# Altium project STM32F466_EVAL_BOARD.PrjPcb
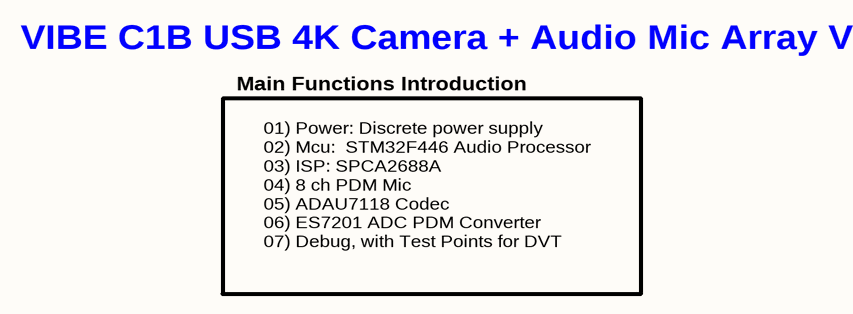
[diagram p0: 00_TITLE.SchDoc]
Revision: V1.0; Title: Test
13 sheets, 217 parts. Net scope: global (net labels, ports and power ports of the same name join across sheets).
Board files: C1B_EVAL_DEV.PcbDoc, PCB1.PcbDoc
Sheets:
  00_TITLE.SchDoc
  01_SYSTEM_DIAGRAM.SchDoc
  02_REVISIONS.SchDoc
  05_SM32_MCU.SchDoc
  06_USB_HUB20.SchDoc
  07_ISP.SchDoc
  10_PDM_MICS.SchDoc
  11_ES7201_LOOPBACK.SchDoc
  12_ADAU7118_CODEC.SchDoc
  21_POWER_DOMAINS.SchDoc
  22_USB_CONNECTOR.SchDoc
  99_MISCS.SchDoc
  temp_packages.SchDoc

## Sheet 00_TITLE.SchDoc: Test
size B; DocumentNumber: 1; SheetNumber: 1; SheetTotal: 12

### Notes on the sheet
- VIBE C1B USB 4K Camera + Audio Mic Array V1
- Main Functions Introduction
- 01) Power: Discrete power supply
  02) Mcu:  STM32F446 Audio Processor
  03) ISP: SPCA2688A
  04) 8 ch PDM Mic
  05) ADAU7118 Codec
  06) ES7201 ADC PDM Converter
  07) Debug, with Test Points for DVT
- Title
- Size:
- Date:
- B
- Number:
- Time:
- Revision:
- Sheet
- of
- Author: Edward Lai
- Email: edward@vibe.us
- Vibe Inc
- Hangzhou
- vibe.us <http://vibe.us>
- File:

## Sheet 01_SYSTEM_DIAGRAM.SchDoc: System Diagram
size B; DocumentNumber: 2; SheetNumber: 2; SheetTotal: 12

### Notes on the sheet
- Title
- Size:
- Date:
- B
- Number:
- Time:
- Revision:
- Sheet
- of
- Author: Edward Lai
- Email: edward@vibe.us
- Vibe Inc
- Hangzhou
- vibe.us <http://vibe.us>
- File:

## Sheet 02_REVISIONS.SchDoc: Revisions
size B; DocumentNumber: 3; SheetNumber: 3; SheetTotal: 12
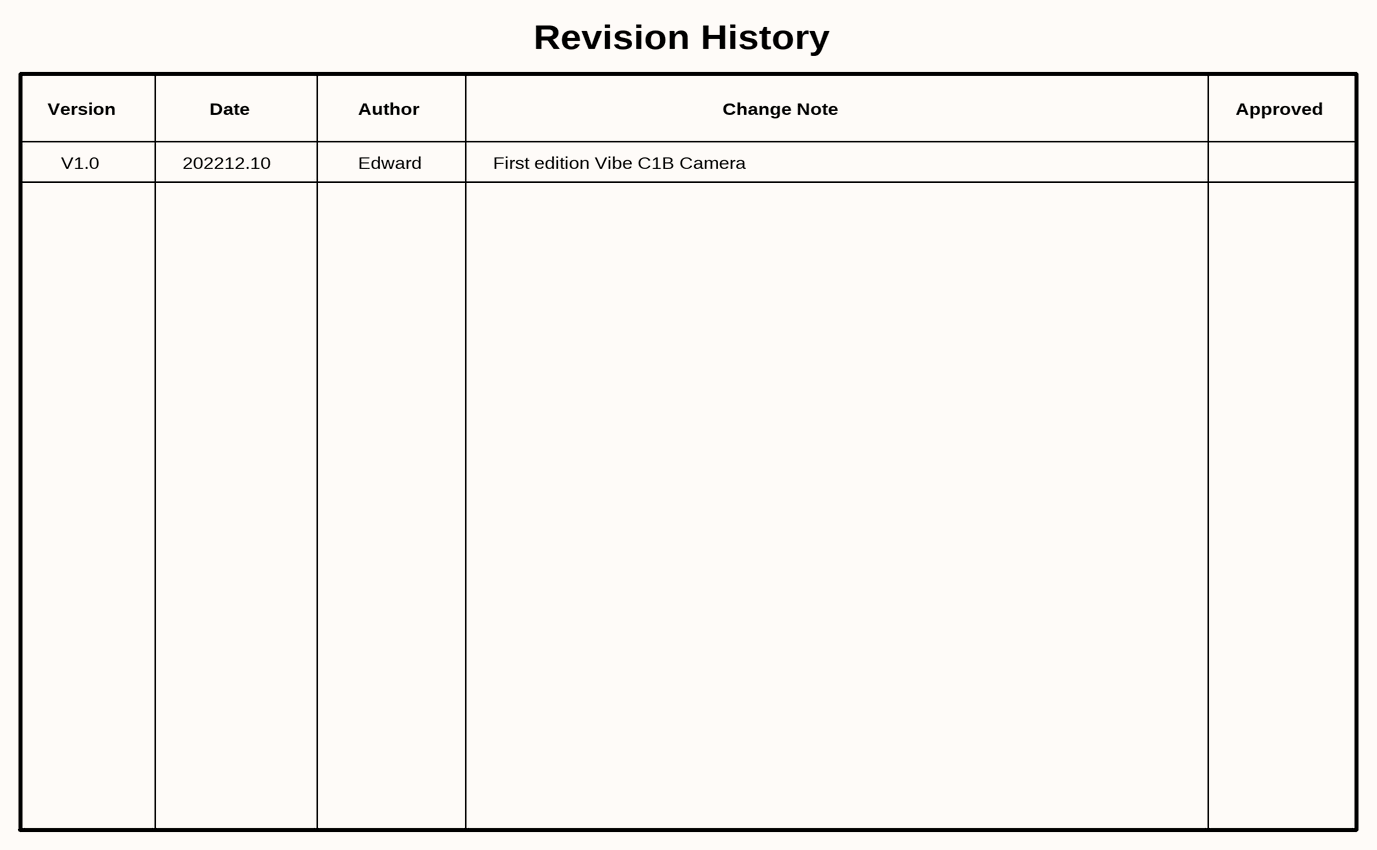
[diagram p1: 02_REVISIONS.SchDoc]

### Notes on the sheet
- Revision History
- Version
- Date
- Author
- Change Note
- Approved
- V1.0
- 202212.10
- Edward
- First edition Vibe C1B Camera
- Title
- Size:
- Date:
- B
- Number:
- Time:
- Revision:
- Sheet
- of
- Author: Edward Lai
- Email: edward@vibe.us
- Vibe Inc
- Hangzhou
- vibe.us <http://vibe.us>
- File:

## Sheet 05_SM32_MCU.SchDoc: STM32 F446 MCU
size B; DocumentNumber: 4; SheetNumber: 4; SheetTotal: 12
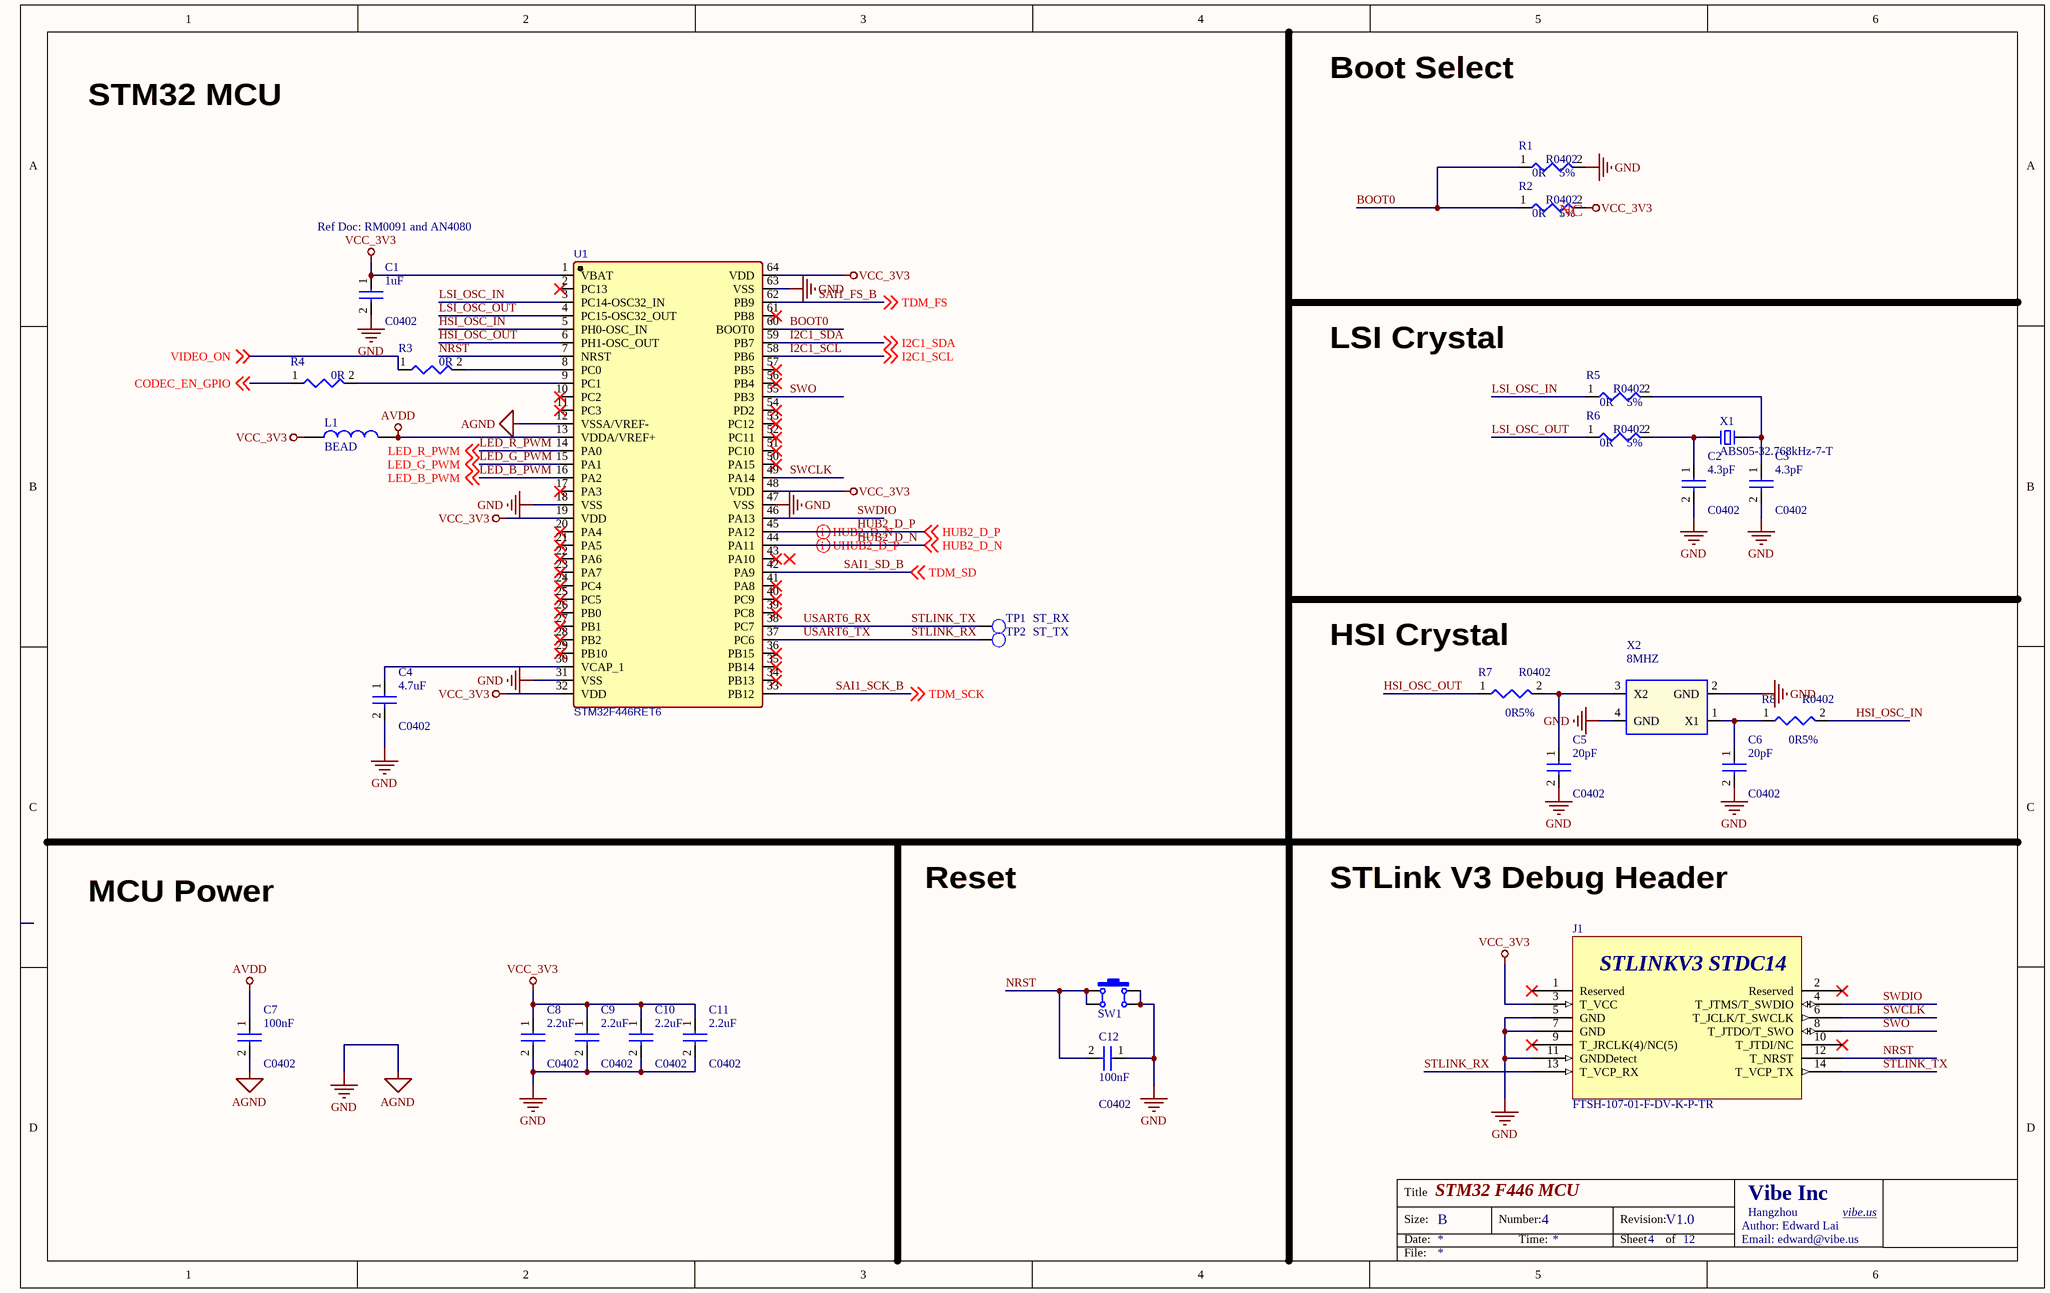
[diagram p2: 05_SM32_MCU.SchDoc]

### Parts
C1  1uF  PCB Footprint: C0402  [C0402_L]
C2  4.3pF  PCB Footprint: C0402  [C0402_L]
C3  4.3pF  PCB Footprint: C0402  [C0402_L]
C4  4.7uF  PCB Footprint: C0402  [C0402_L]
C5  20pF  PCB Footprint: C0402  [C0402_L]
C6  20pF  PCB Footprint: C0402  [C0402_L]
C7  100nF  PCB Footprint: C0402  [C0402_L]
C8  2.2uF  PCB Footprint: C0402  [C0402_L]
C9  2.2uF  PCB Footprint: C0402  [C0402_L]
C10  2.2uF  PCB Footprint: C0402  [C0402_L]
C11  2.2uF  PCB Footprint: C0402  [C0402_L]
C12  100nF  PCB Footprint: C0402  [C0402_L]
J1  FTSH-107-01-F-DV-K-P-TR  [SAMTEC-FTSH-107-01-X-DV]
L1  BEAD  [L0402]
R1  0R  Tolerance: 5%  [R0402]
R2  0R  Tolerance: 5%  [R0402]  (net tie, no BOM)
R3  0R  [R0402]
R4  0R  [R0402]
R5  0R  Tolerance: 5%  [R0402]
R6  0R  Tolerance: 5%  [R0402]
R7  0R  Tolerance: 5%  [R0402]
R8  0R  Tolerance: 5%  [R0402]
SW1  4x4x1.5  [TSW SMD-6*6*5]  (value not drawn)
TP1  ST_RX  [TP_0R70]  (no BOM)
TP2  ST_TX  [TP_0R70]  (no BOM)
U1  STM32F446RET6  [LQFP64_L]
X1  ABS05-32.768kHz-7-T  [XTAL_3215-32.768K]
X2  8MHZ  [XTAL_3225-8MHZ]

### Nets
AGND: C1.2 C2.2 C3.2 C4.2 C5.2 C6.2 C7.2 C8.2 C9.2 C10.2 C11.2 C12.1 J1.5(GND) J1.7(GND) J1.11(GNDDetect) R1.2 SW1.2 SW1.3 U1.12(VSSA/VREF-) U1.18(VSS) U1.31(VSS) U1.47(VSS) U1.63(VSS) X2.2(GND) X2.4(GND)  [also labelled GND]
AVDD: C7.1 L1.2 U1.13(VDDA/VREF+)
VCC_3V3: C1.1 C8.1 C9.1 C10.1 C11.1 J1.3(T_VCC) L1.1 R2.2 U1.1(VBAT) U1.19(VDD) U1.32(VDD) U1.48(VDD) U1.64(VDD)
BOOT0: R1.1 R2.1 U1.60(BOOT0)
CODEC_EN_GPIO: R4.1 ; off-sheet CODEC_EN_GPIO  [project net CODEC_EN]
HSI_OSC_IN: R8.2 U1.5(PH0-OSC_IN)
HSI_OSC_OUT: R7.1 U1.6(PH1-OSC_OUT)
HUB2_D_N: U1.44(PA11) ; off-sheet HUB2_D_N
HUB2_D_P: U1.45(PA12) ; off-sheet HUB2_D_P
I2C1_SCL: U1.58(PB6) ; off-sheet I2C1_SCL
I2C1_SDA: U1.59(PB7) ; off-sheet I2C1_SDA
LED_B_PWM: U1.16(PA2) ; off-sheet LED_B_PWM
LED_G_PWM: U1.15(PA1) ; off-sheet LED_G_PWM
LED_R_PWM: U1.14(PA0) ; off-sheet LED_R_PWM
LSI_OSC_IN: R5.1 U1.3(PC14-OSC32_IN)
LSI_OSC_OUT: R6.1 U1.4(PC15-OSC32_OUT)
NRST: C12.2 J1.12(T_NRST) SW1.1 SW1.4 U1.7(NRST)
SAI1_FS_B: U1.62(PB9) ; off-sheet TDM_FS  [also labelled TDM_FS]
SAI1_SCK_B: U1.33(PB12) ; off-sheet TDM_SCK  [also labelled TDM_SCK]
SAI1_SD_B: U1.42(PA9) ; off-sheet TDM_SD  [also labelled TDM_SD]
STLINK_RX: J1.13(T_VCP_RX) TP2.1 U1.37(PC6)  [also labelled USART6_TX]
STLINK_TX: J1.14(T_VCP_TX) TP1.1 U1.38(PC7)  [also labelled USART6_RX]
SWCLK: J1.6(T_JCLK/T_SWCLK) U1.49(PA14)
SWDIO: J1.4(T_JTMS/T_SWDIO) U1.46(PA13)
SWO: J1.8(T_JTDO/T_SWO) U1.55(PB3)
VIDEO_ON: R3.1 ; off-sheet VIDEO_ON  [project net XHIGHDRV]
NetC2_1: C2.1 R6.2 X1.1
NetC3_1: C3.1 R5.2 X1.2
NetC4_1: C4.1 U1.30(VCAP_1)
NetC5_1: C5.1 R7.2 X2.3(X2)
NetC6_1: C6.1 R8.1 X2.1(X1)
NetR3_2: R3.2 U1.8(PC0)
NetR4_2: R4.2 U1.9(PC1)

Not connected (* = marked no-connect by the designer): J1 1(Reserved)* 2(Reserved)* 9(T_JRCLK(4)/NC(5))* 10(T_JTDI/NC)*; U1 2(PC13)* 10(PC2)* 11(PC3)* 17(PA3)* 20(PA4)* 21(PA5)* 22(PA6)* 23(PA7)* 24(PC4)* 25(PC5)* 26(PB0)* 27(PB1)* 28(PB2)* 29(PB10)* 34(PB13)* 35(PB14)* 36(PB15)* 39(PC8)* 40(PC9)* 41(PA8)* 43(PA10)* 50(PA15)* 51(PC10)* 52(PC11)* 53(PC12)* 54(PD2)* 56(PB4)* 57(PB5)* 61(PB8)*

### Layout directives
differential pair; differential pair class USB: HUB2_D_N, HUB2_D_P

### Notes on the sheet
- Boot Select
- STM32 MCU
- Ref Doc: RM0091 and AN4080
- (near R2) NC
- LSI Crystal
- (near R7) HSI Crystal
- MCU Power
- Reset
- STLink V3 Debug Header
- Title
- Size:
- Date:
- B
- Number:
- Time:
- Revision:
- Sheet
- of
- Author: Edward Lai
- Email: edward@vibe.us
- Vibe Inc
- Hangzhou
- vibe.us <http://vibe.us>
- File:
- (in symbol FTSH-107-01-F-DV-K-P-TR) STLINKV3 STDC14

### Library data of the parts
C1 = CAP NP_Dup1: cap,1.00uF,+/-10%,10V,X5R,C0402; Priority: A; Part Type: C0402
C2 C3 = CAP NP_Dup1: cap,4.3pF,+/-10%,25V,X5R,C0402; Priority: A; Part Type: C0402
C4 = CAP NP_Dup1: cap,4.70uF,+/-10%,6.3V,X5R,C0402; Priority: A; Part Type: C0402
C5 C6 = CAP NP_Dup1: cap,20pF,+/-10%,25V,X5R,C0402; Priority: A; Part Type: C0402
C7 C12 = CAP NP_Dup1: cap,100.00nF,+/-10%,10V,X5R,C0402; Priority: A; Part Type: C0402
C8-C11 = CAP NP_Dup1: cap,2.20uF,+/-10%,10V,X5R,C0402; Priority: A; Part Type: C0402
J1 = FTSH-107-01-F-DV-K-P-TR: Samtec 14Pin 2x7 Header Connector. / STM32_STLINK_V3 Debug
L1 = L-AL: 鐵氧體磁珠 33ohm 0.55A 550mOhms 0402 Chip Bead
R1 R2 R5-R8 = RESISTOR: 通用厚膜电阻,0R,+/-5%,R0402; Priority: A; PCB Footprint: R0402; Part Type: 通用厚膜电阻
R3 R4 = RESISTOR: 通用厚膜电阻,0R,+/-5%,R0402; Tolerance: 5%; Priority: A; PCB Footprint: R0402; Part Type: 通用厚膜电阻
SW1 = SW SMD-4x4: 贴片4x4轻触开关
TP1 TP2 = TP: Test Point 0.7mm; PCB Footprint: TP_0R50; Priority: A; Part Type: TP
X1 = XTAL-2P: ABS05-32.768kHz-7-T / 3215 2脚无源晶振(谐振器）
X2 = CRYSTAL_4P: 8MHZ (16pF), 3.2 mm x 2.5 mm / 无源晶振(谐振器）

## Sheet 06_USB_HUB20.SchDoc: USB Hub 2.0
size B; DocumentNumber: 5; Revision: V1.0; SheetNumber: 5; SheetTotal: 12
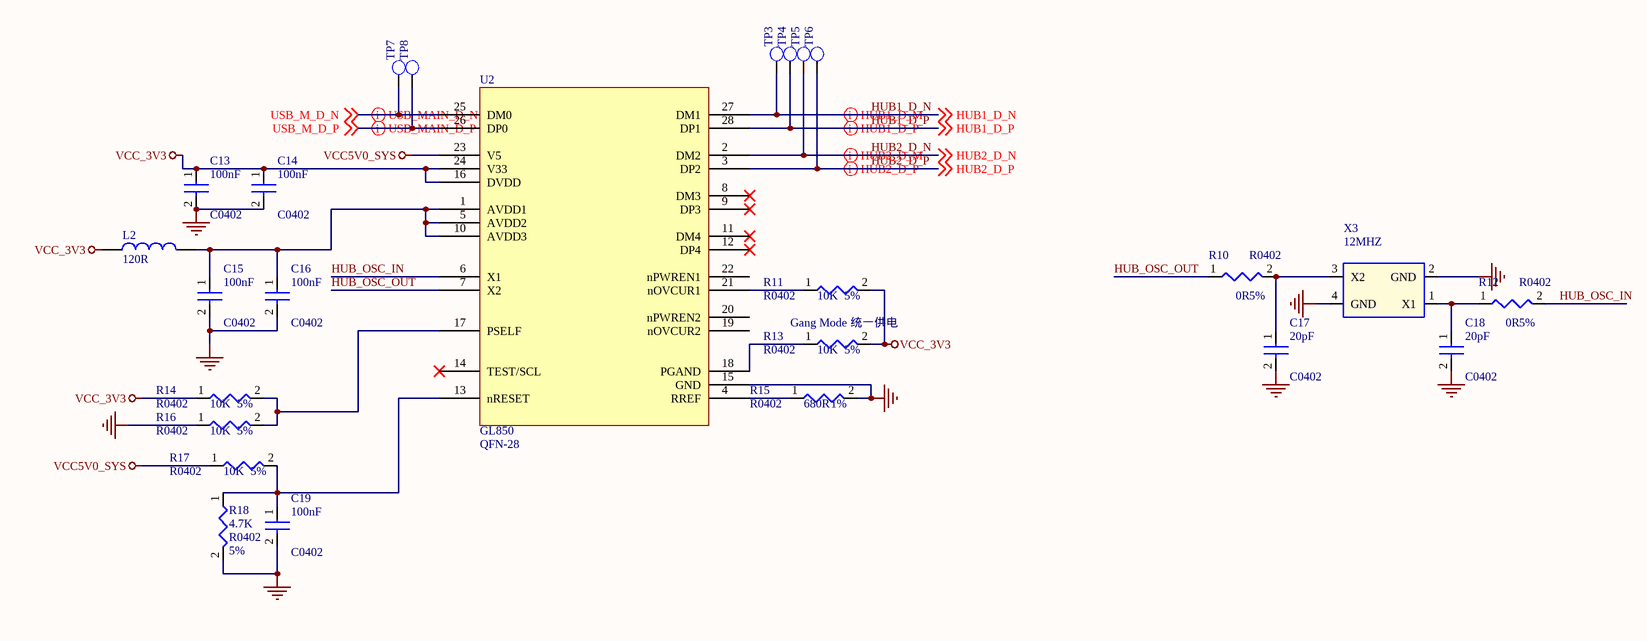
[diagram p3: 06_USB_HUB20.SchDoc]

### Parts
(Parts that share a designator on the sheet are numbered #1, #2 ... from top to bottom, then left to right.)
C13  100nF  PCB Footprint: C0402  [C0402_L]
C14  100nF  PCB Footprint: C0402  [C0402_L]
C15  100nF  PCB Footprint: C0402  [C0402_L]
C16  100nF  PCB Footprint: C0402  [C0402_L]
C17  20pF  PCB Footprint: C0402  [C0402_L]
C18  20pF  PCB Footprint: C0402  [C0402_L]
C19  100nF  PCB Footprint: C0402  [C0402_L]
L2  120R  [L0402]
R10  0R  Tolerance: 5%  [R0402]
R11  10K  Tolerance: 5%  [R0402]
R12  0R  Tolerance: 5%  [R0402]
R13  10K  Tolerance: 5%  [R0402]
R14  10K  Tolerance: 5%  [R0402]
R15  680R  Tolerance: 1%  [R0402]
R16#1  10K  Tolerance: 5%  [R0402]
R17#1  10K  Tolerance: 5%  [R0402]
R18#1  4.7K  Tolerance: 5%  [R0402]
TP3  (no value)  [TP_0R70]  (no BOM)
TP4  (no value)  [TP_0R70]  (no BOM)
TP5  (no value)  [TP_0R70]  (no BOM)
TP6  (no value)  [TP_0R70]  (no BOM)
TP7  (no value)  [TP_0R70]  (no BOM)
TP8  (no value)  [TP_0R70]  (no BOM)
U2  GL850  [QFN-28]
X3  12MHZ  [XTAL_3225-8MHZ]

### Nets
GND: C13.2 C14.2 C15.2 C16.2 C17.2 C18.2 C19.2 R15.2 R16#1.1 R18#1.2 U2.15(GND) X3.2(GND) X3.4(GND)  [project net AGND]
VCC5V0_SYS: R17#1.1 U2.23(V5)
VCC_3V3: C13.1 C14.1 L2.1 R11.2 R13.2 R14.1 U2.16(DVDD) U2.24(V33)
HUB1_D_N: TP3.1 U2.27(DM1) ; off-sheet HUB1_D_N
HUB1_D_P: TP4.1 U2.28(DP1) ; off-sheet HUB1_D_P
HUB2_D_N: TP5.1 U2.2(DM2) ; off-sheet HUB2_D_N
HUB2_D_P: TP6.1 U2.3(DP2) ; off-sheet HUB2_D_P
HUB_OSC_IN: R12.2 U2.6(X1)
HUB_OSC_OUT: R10.1 U2.7(X2)
USB_M_D_N: TP7.1 U2.25(DM0) ; off-sheet USB_M_D_N
USB_M_D_P: TP8.1 U2.26(DP0) ; off-sheet USB_M_D_P
NetC15_1: C15.1 C16.1 L2.2 U2.1(AVDD1) U2.5(AVDD2) U2.10(AVDD3)
NetC17_1: C17.1 R10.2 X3.3(X2)
NetC18_1: C18.1 R12.1 X3.1(X1)
NetC19_1: C19.1 R17#1.2 R18#1.1 U2.13(nRESET)
NetR11_1: R11.1 U2.21(nOVCUR1)
NetR13_1: R13.1 U2.18(PGAND)
NetR14_2: R14.2 R16#1.2 U2.17(PSELF)
NetR15_1: R15.1 U2.4(RREF)

Not connected (* = marked no-connect by the designer): U2 8(DM3)* 9(DP3)* 11(DM4)* 12(DP4)* 14(TEST/SCL)* 19(nOVCUR2) 20(nPWREN2) 22(nPWREN1)

### Layout directives
differential pair; differential pair class USB: HUB1_D_N, HUB1_D_P, HUB2_D_N, HUB2_D_P, USB_M_D_N, USB_M_D_P

### Notes on the sheet
- (near R13) Gang Mode 统一供电
- Title
- Size:
- Date:
- B
- Number:
- Time:
- Revision:
- Sheet
- of
- Author: Edward Lai
- Email: edward@vibe.us
- Vibe Inc
- Hangzhou
- vibe.us <http://vibe.us>
- File:

### Library data of the parts
C13-C16 C19 = CAP NP_Dup1: as C7 on sheet 05_SM32_MCU; Part Type: C0402
C17 C18 = CAP NP_Dup1: as C5 on sheet 05_SM32_MCU; Part Type: C0402
L2 = L: 鐵氧體磁珠 120 OHM 25%
R10 R12 = RESISTOR: 通用厚膜电阻,0R,+/-5%,R0402; Priority: A; PCB Footprint: R0402; Part Type: 通用厚膜电阻
R11 R13 R14 R16#1 R17#1 = RESISTOR: 通用厚膜电阻,10K,+/-5%,R0402; Priority: A; PCB Footprint: R0402; Part Type: 通用厚膜电阻
R15 = RESISTOR: 通用厚膜电阻,680R,+/-1%,R0402; Priority: A; PCB Footprint: R0402; Part Type: 通用厚膜电阻
R18#1 = RESISTOR: 通用厚膜电阻,4.7K,+/-5%,R0402; Priority: A; PCB Footprint: R0402; Part Type: 通用厚膜电阻
TP3-TP8 = TP: as TP1 on sheet 05_SM32_MCU; Part Type: TP
U2 = GL850G: GL850 4 Port USB HUB QFN-28; Package: QFN-28
X3 = CRYSTAL_4P: 12MHZ (16pF), 3.2 mm x 2.5 mm / 无源晶振(谐振器）

## Sheet 07_ISP.SchDoc: SPCA2688 ISP
size C; DocumentNumber: 9; SheetNumber: 9; SheetTotal: 12
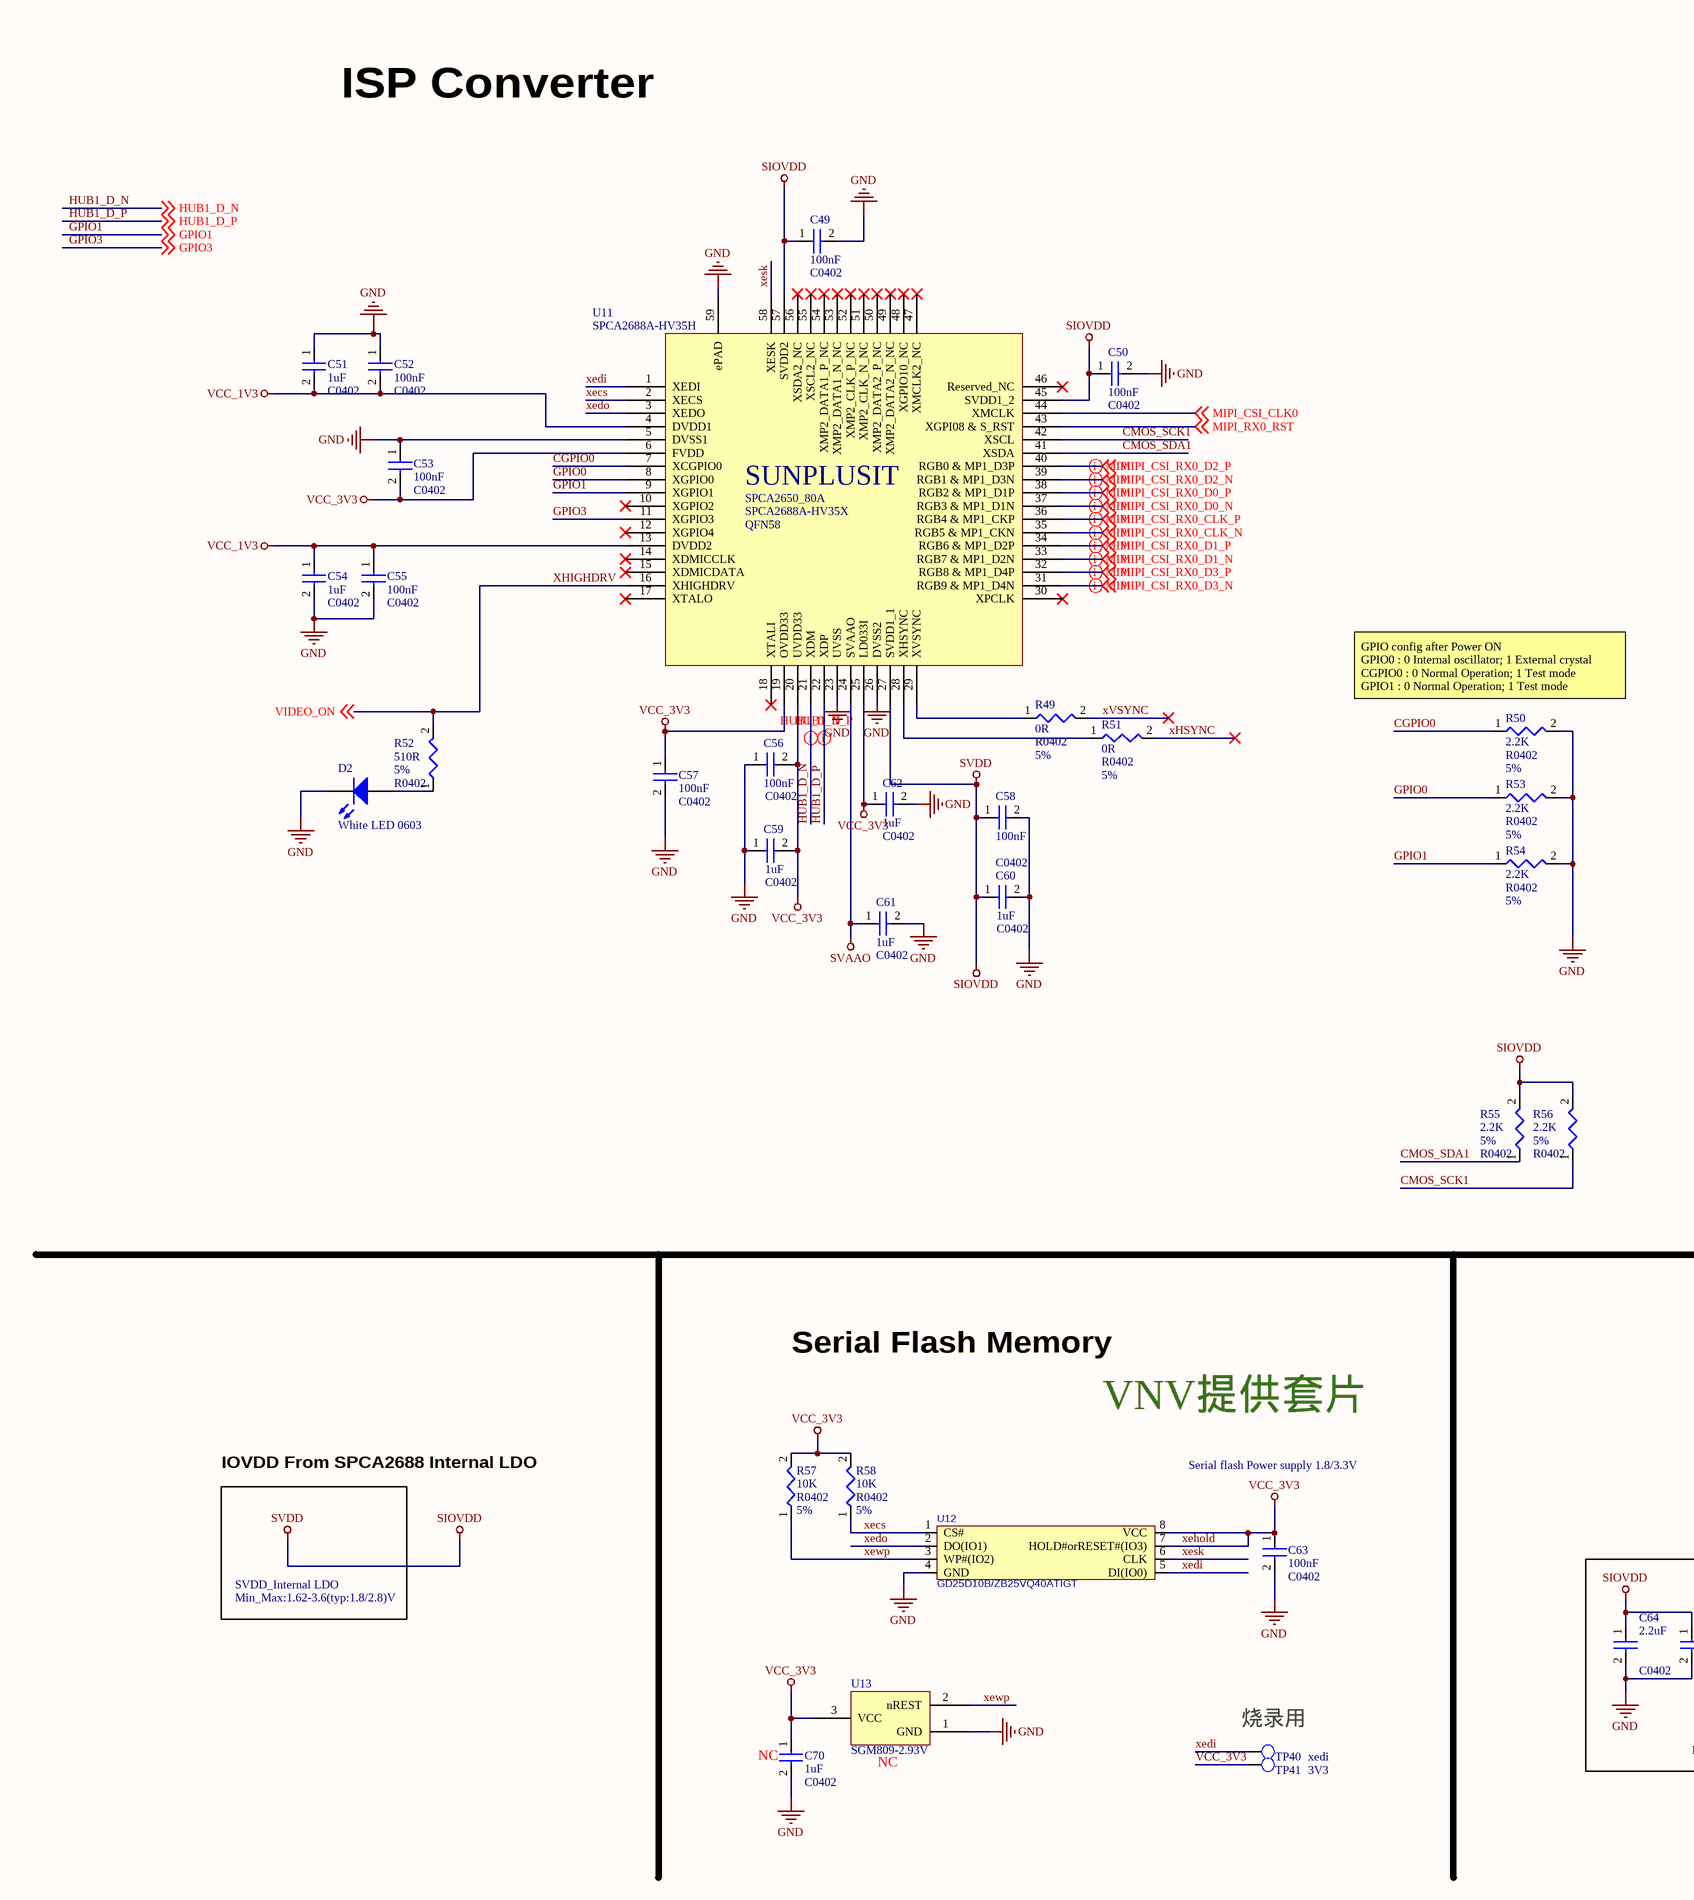
[diagram p4: 07_ISP.SchDoc, left]
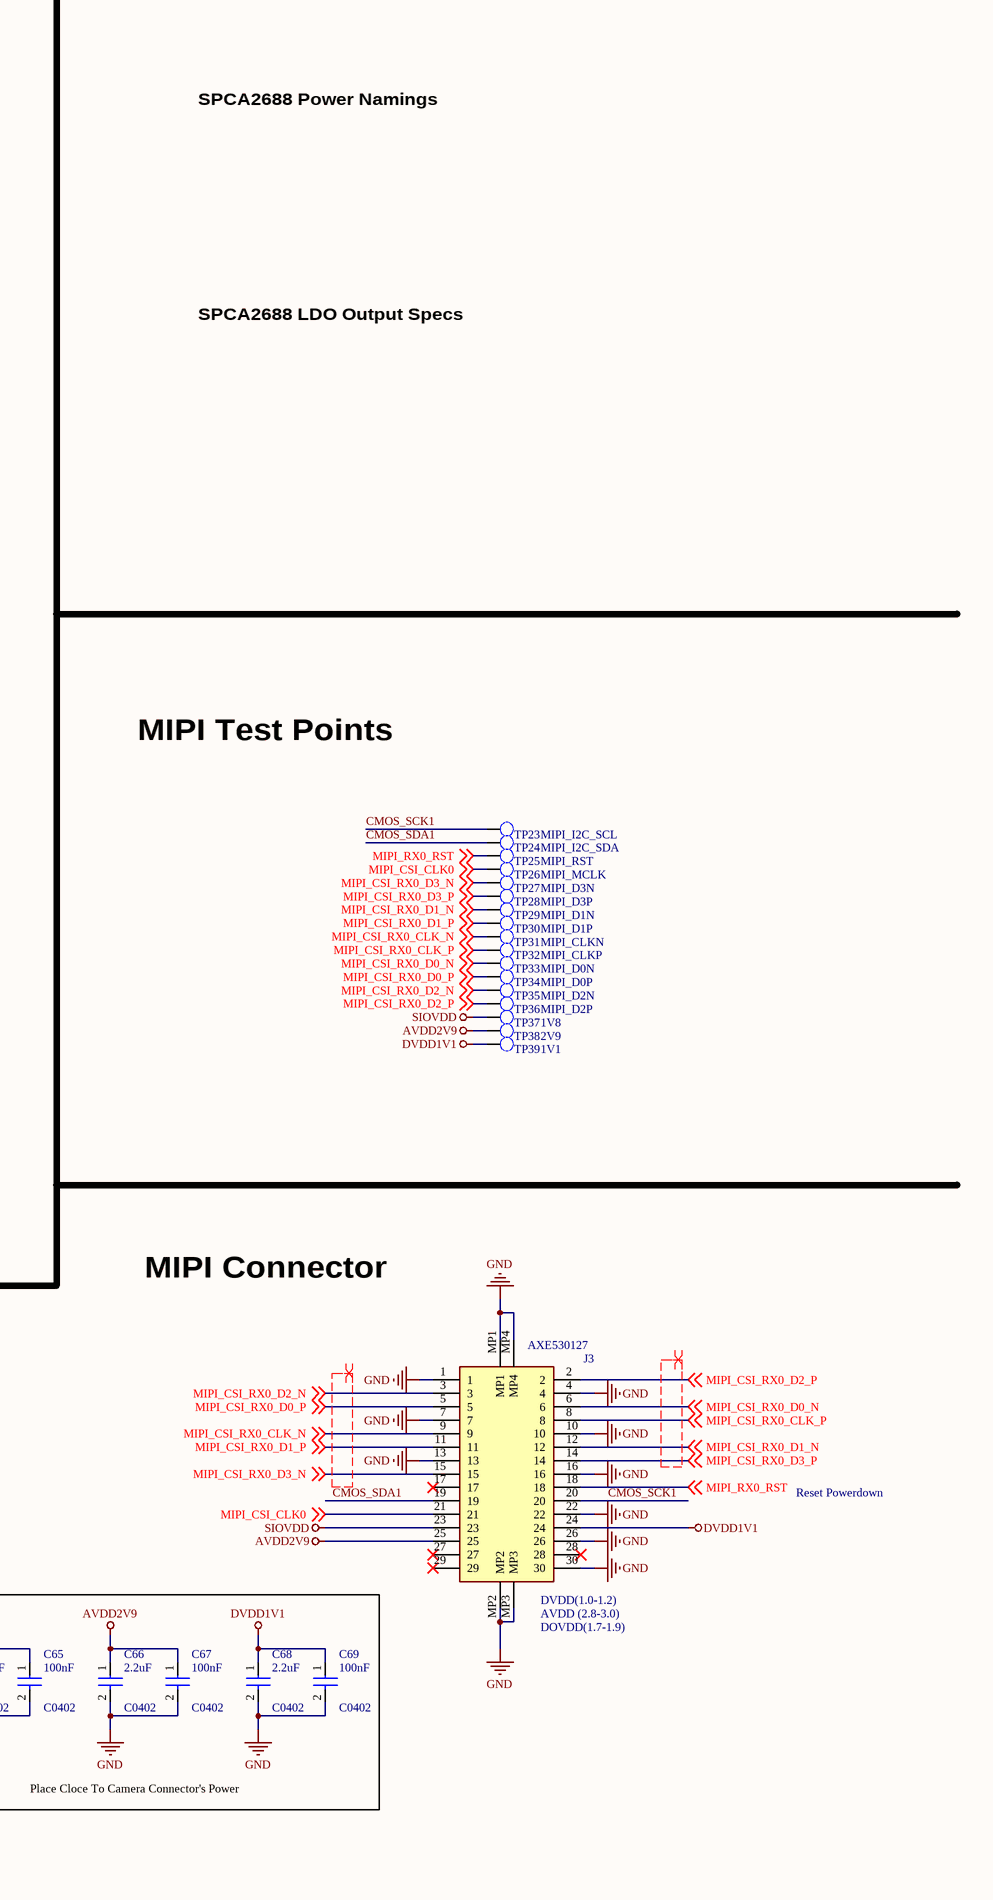
[diagram p5: 07_ISP.SchDoc, right]

### Parts
(Parts that share a designator on the sheet are numbered #1, #2 ... from top to bottom, then left to right.)
C49  100nF  PCB Footprint: C0402  [C0402_L]
C50  100nF  PCB Footprint: C0402  [C0402_L]
C51  1uF  PCB Footprint: C0402  [C0402_L]
C52  100nF  PCB Footprint: C0402  [C0402_L]
C53  100nF  PCB Footprint: C0402  [C0402_L]
C54#1  1uF  PCB Footprint: C0402  [C0402_L]
C55#1  100nF  PCB Footprint: C0402  [C0402_L]
C56#1  100nF  PCB Footprint: C0402  [C0402_L]
C57#1  100nF  PCB Footprint: C0402  [C0402_L]
C58#1  100nF  PCB Footprint: C0402  [C0402_L]
C59#1  1uF  PCB Footprint: C0402  [C0402_L]
C60#1  1uF  PCB Footprint: C0402  [C0402_L]
C61#1  1uF  PCB Footprint: C0402  [C0402_L]
C62#1  1uF  PCB Footprint: C0402  [C0402_L]
C63#1  100nF  PCB Footprint: C0402  [C0402_L]
C64#1  2.2uF  PCB Footprint: C0402  [C0402_L]
C65#1  100nF  PCB Footprint: C0402  [C0402_L]
C66#1  2.2uF  PCB Footprint: C0402  [C0402_L]
C67#1  100nF  PCB Footprint: C0402  [C0402_L]
C68#1  2.2uF  PCB Footprint: C0402  [C0402_L]
C69#1  100nF  PCB Footprint: C0402  [C0402_L]
C70  1uF  PCB Footprint: C0402  [C0402_L]
D2  White LED 0603  [LED0603_W]
J3  AXE530127  [AXE530127_counterclock_pin]
R49#1  0R  Tolerance: 5%  [R0402]  (net tie, no BOM)
R50#1  2.2K  Tolerance: 5%  [R0402]
R51#1  0R  Tolerance: 5%  [R0402]  (net tie, no BOM)
R52#1  510R  Tolerance: 5%  [R0402]
R53  2.2K  Tolerance: 5%  [R0402]
R54  2.2K  Tolerance: 5%  [R0402]
R55  2.2K  Tolerance: 5%  [R0402]
R56  2.2K  Tolerance: 5%  [R0402]
R57  10K  Tolerance: 5%  [R0402]
R58  10K  Tolerance: 5%  [R0402]
TP23  MIPI_I2C_SCL  [TP_0R70]  (no BOM)
TP24  MIPI_I2C_SDA  [TP_0R70]  (no BOM)
TP25  MIPI_RST  [TP_0R70]  (no BOM)
TP26  MIPI_MCLK  [TP_0R70]  (no BOM)
TP27  MIPI_D3N  [TP_0R70]  (no BOM)
TP28  MIPI_D3P  [TP_0R70]  (no BOM)
TP29  MIPI_D1N  [TP_0R70]  (no BOM)
TP30  MIPI_D1P  [TP_0R70]  (no BOM)
TP31  MIPI_CLKN  [TP_0R70]  (no BOM)
TP32#1  MIPI_CLKP  [TP_0R70]  (no BOM)
TP33#1  MIPI_D0N  [TP_0R70]  (no BOM)
TP34#1  MIPI_D0P  [TP_0R70]  (no BOM)
TP35#1  MIPI_D2N  [TP_0R70]  (no BOM)
TP36#1  MIPI_D2P  [TP_0R70]  (no BOM)
TP37  1V8  [TP_0R70]  (no BOM)
TP38  2V9  [TP_0R70]  (no BOM)
TP39  1V1  [TP_0R70]  (no BOM)
TP40  xedi  [TP_0R70]  (no BOM)
TP41  3V3  [TP_0R70]  (no BOM)
U11#1  SPCA2688A-HV35H  [SPCA2680A_QFN58]
U12  GD25D10B/ZB25VQ40ATIGT  [SOIC-8]
U13  SGM809-2.93V  [SOT23]  (net tie, no BOM)

### Blocks framed on the sheet
Place Cloce To Camera Connector's Power: C64#1 C65#1 C66#1 C67#1 C68#1 C69#1

### Nets
AVDD2V9: C66#1.1 C67#1.1 J3.25 TP38.1
DVDD1V1: C68#1.1 C69#1.1 J3.24 TP39.1
GND: C49.2 C50.2 C51.1 C52.1 C53.1 C54#1.2 C55#1.2 C56#1.1 C57#1.2 C58#1.2 C59#1.1 C60#1.2 C61#1.2 C62#1.2 C63#1.2 C64#1.2 C65#1.2 C66#1.2 C67#1.2 C68#1.2 C69#1.2 C70.2 D2.2(K) J3.1 J3.4 J3.7 J3.10 J3.13 J3.16 J3.22 J3.26 J3.30 J3.MP1 J3.MP2 J3.MP3 J3.MP4 R50#1.2 R53.2 R54.2 U11#1.5(DVSS1) U11#1.23(UVSS) U11#1.26(DVSS2) U11#1.59(ePAD) U12.4(GND) U13.1(GND)  [project net AGND]
SIOVDD: C49.1 C50.1 C58#1.1 C60#1.1 C64#1.1 C65#1.1 J3.23 R55.2 R56.2 TP37.1 U11#1.27(SVDD1_1) U11#1.45(SVDD1_2) U11#1.57(SVDD2)  [also labelled SVDD]
SVAAO: C61#1.1 U11#1.24(SVAAO)
VCC_1V3: C51.2 C52.2 C54#1.1 C55#1.1 U11#1.4(DVDD1) U11#1.13(DVDD2)
VCC_3V3: C53.2 C56#1.2 C57#1.1 C59#1.2 C62#1.1 C63#1.1 C70.1 R57.2 R58.2 TP41.1 U11#1.6(FVDD) U11#1.19(OVDD33) U11#1.20(UVDD33) U11#1.25(LD033I) U12.7(HOLD#orRESET#(IO3)) U12.8(VCC) U13.3(VCC)  [also labelled xehold]
CGPIO0: R50#1.1 U11#1.7(XCGPIO0)
CMOS_SCK1: J3.20 R56.1 TP23.1 U11#1.42(XSCL)
CMOS_SDA1: J3.19 R55.1 TP24.1 U11#1.41(XSDA)
GPIO0: R53.1 U11#1.8(XGPIO0)
GPIO1: R54.1 U11#1.9(XGPIO1) ; off-sheet GPIO1
GPIO3: U11#1.11(XGPIO3) ; off-sheet GPIO3
HUB1_D_N: U11#1.21(XDM) ; off-sheet HUB1_D_N
HUB1_D_P: U11#1.22(XDP) ; off-sheet HUB1_D_P
MIPI_CSI_CLK0: J3.21 TP26.1 U11#1.44(XMCLK) ; off-sheet MIPI_CSI_CLK0
MIPI_CSI_RX0_CLK_N: J3.9 TP31.1 U11#1.35(RGB5_&_MP1_CKN) ; off-sheet MIPI_CSI_RX0_CLK_N
MIPI_CSI_RX0_CLK_P: J3.8 TP32#1.1 U11#1.36(RGB4_&_MP1_CKP) ; off-sheet MIPI_CSI_RX0_CLK_P
MIPI_CSI_RX0_D0_N: J3.6 TP33#1.1 U11#1.37(RGB3_&_MP1_D1N) ; off-sheet MIPI_CSI_RX0_D0_N
MIPI_CSI_RX0_D0_P: J3.5 TP34#1.1 U11#1.38(RGB2_&_MP1_D1P) ; off-sheet MIPI_CSI_RX0_D0_P
MIPI_CSI_RX0_D1_N: J3.12 TP29.1 U11#1.33(RGB7_&_MP1_D2N) ; off-sheet MIPI_CSI_RX0_D1_N
MIPI_CSI_RX0_D1_P: J3.11 TP30.1 U11#1.34(RGB6_&_MP1_D2P) ; off-sheet MIPI_CSI_RX0_D1_P
MIPI_CSI_RX0_D2_N: J3.3 TP35#1.1 U11#1.39(RGB1_&_MP1_D3N) ; off-sheet MIPI_CSI_RX0_D2_N
MIPI_CSI_RX0_D2_P: J3.2 TP36#1.1 U11#1.40(RGB0_&_MP1_D3P) ; off-sheet MIPI_CSI_RX0_D2_P
MIPI_CSI_RX0_D3_N: J3.15 TP27.1 U11#1.31(RGB9_&_MP1_D4N) ; off-sheet MIPI_CSI_RX0_D3_N
MIPI_CSI_RX0_D3_P: J3.14 TP28.1 U11#1.32(RGB8_&_MP1_D4P) ; off-sheet MIPI_CSI_RX0_D3_P
MIPI_RX0_RST: J3.18 TP25.1 U11#1.43(XGPI08_&_S_RST) ; off-sheet MIPI_RX0_RST
xecs: R58.1 U11#1.2(XECS) U12.1(CS#)
xedi: TP40.1 U11#1.1(XEDI) U12.5(DI(IO0))
xedo: U11#1.3(XEDO) U12.2(DO(IO1))
xesk: U11#1.58(XESK) U12.6(CLK)
xewp: R57.1 U12.3(WP#(IO2)) U13.2(nREST)
XHIGHDRV: R52#1.2 U11#1.16(XHIGHDRV) ; off-sheet VIDEO_ON  [also labelled VIDEO_ON]
xHSYNC: R51#1.2
xVSYNC: R49#1.2
NetD2_1: D2.1(A) R52#1.1
NetR49#1_1: R49#1.1 U11#1.29(XVSYNC)
NetR51#1_1: R51#1.1 U11#1.28(XHSYNC)

Not connected (* = marked no-connect by the designer): J3 17* 27* 28* 29*; U11#1 10(XGPIO2)* 12(XGPIO4)* 14(XDMICCLK)* 15(XDMICDATA)* 17(XTALO)* 18(XTALI)* 30(XPCLK)* 46(Reserved_NC)* 47(XMCLK2_NC)* 48(XGPIO10_NC)* 49(XMP2_DATA2_N_NC)* 50(XMP2_DATA2_P_NC)* 51(XMP2_CLK_N_NC)* 52(XMP2_CLK_P_NC)* 53(XMP2_DATA1_N_NC)* 54(XMP2_DATA1_P_NC)* 55(XSCL2_NC)* 56(XSDA2_NC)*

### Layout directives
differential pair; differential pair class USB; net class USB: HUB1_D_N, HUB1_D_P
differential pair; net class MIPI; differential pair class MIPI: MIPI_CSI_RX0_CLK_N, MIPI_CSI_RX0_CLK_P, MIPI_CSI_RX0_D0_N, MIPI_CSI_RX0_D0_P, MIPI_CSI_RX0_D1_N, MIPI_CSI_RX0_D1_P, MIPI_CSI_RX0_D2_N, MIPI_CSI_RX0_D2_P, MIPI_CSI_RX0_D3_N, MIPI_CSI_RX0_D3_P
differential pair: (no net found under the mark)

### Notes on the sheet
- SPCA2688 Power Namings
- ISP Converter
- SPCA2688 LDO Output Specs
- (near R50#1) GPIO config after Power ON
  GPIO0 : 0 Internal oscillator; 1 External crystal
  CGPIO0 : 0 Normal Operation; 1 Test mode
  GPIO1 : 0 Normal Operation; 1 Test mode
- MIPI Test Points
- MIPI Connector
- Serial Flash Memory
- VNV提供套片
- IOVDD From SPCA2688 Internal LDO
- Serial flash Power supply 1.8/3.3V
- Reset Powerdown
- SVDD_Internal LDO
- Min_Max:1.62-3.6(typ:1.8/2.8)V
- (near J3) DVDD(1.0-1.2)
- (near J3) AVDD (2.8-3.0)
- (near J3) DOVDD(1.7-1.9)
- 烧录用
- (near C70) NC
- (near U13) NC
- Title
- Size:
- Date:
- File:
- C
- Number:
- Time:
- Revision:
- Sheet
- of
- Author: Edward Lai
- Email: edward@vibe.us
- Vibe Inc
- Hangzhou
- vibe.us <http://vibe.us>
- (in symbol SPCA2688A-HV35H) SUNPLUSIT; SPCA2650_80A; SPCA2688A-HV35X; QFN58

### Library data of the parts
C49 C50 C52 C55#1 C56#1 C58#1 C65#1 C67#1 C69#1 = CAP NP_Dup1: cap,100.00nF,+/-10%,25V,X5R,C0402; Priority: A; Part Type: C0402
C51 C54#1 C59#1 C60#1 C61#1 = CAP NP_Dup1: as C1 on sheet 05_SM32_MCU; Part Type: C0402
C53 C57#1 C63#1 = CAP NP_Dup1: cap,1.0uF,+/-10%,6.3V,C0402; Priority: A; Part Type: C0402
C62#1 = CAP NP_Dup1: cap,1uF,+/-10%,25V,X5R,C0402; Priority: A; Part Type: C0402
C64#1 C66#1 C68#1 = CAP NP_Dup1: as C8 on sheet 05_SM32_MCU; Part Type: C0402
C70 = CAP NP_Dup1: cap,1.0uF,+/-10%,6.3V,X5R,C0402; Priority: A; Part Type: C0402
D2 = LED: LED 0603 Wite 发光二极管; Part Type: SS14
J3 = AXE530127: AXE530127 Connector; Manufacturer_Name: Panasonic; Datasheet Link: https://componentsearchengine.com//AXE530127.pdf; Height: 0.97mm; Mouser2 Part Number: 679-AXE530127; Mouser2 Price/Stock: https://www.mouser.com/Search/Refine.aspx?Keyword=679-AXE530127; Manufacturer_Part_Number: AXE530127
R49#1 R51#1 = RESISTOR: 通用厚膜电阻,0R,+/-5%,R0402; Priority: A; PCB Footprint: R0402; Part Type: 通用厚膜电阻
  R51#1: NO BOM: *
R50#1 R53-R56 = RESISTOR: 通用厚膜电阻,2.2K,+/-5%,R0402; Priority: A; PCB Footprint: R0402; Part Type: 通用厚膜电阻
R52#1 = RESISTOR: 通用厚膜电阻,510R,+/-5%,R0402; Priority: A; PCB Footprint: R0402; Part Type: 通用厚膜电阻
R57 R58 = RESISTOR: 通用厚膜电阻,10K,+/-5%,R0402; Priority: A; PCB Footprint: R0402; Part Type: 通用厚膜电阻
TP23-TP31 TP32#1 TP33#1 TP34#1 TP35#1 TP36#1 TP37-TP41 = TP: as TP1 on sheet 05_SM32_MCU; Part Type: TP
U11#1 = SPCA2688A-HV35H: SPCA2688A-HV35H ISP IC / QFN58 0.4MM
U12 = GD25D10B: SPI FLASH SOP-8
U13 = SGM809-2.93V: SGM809-2.93V SOT-23-3/SOT-23 / Microprocessor Supervisory Circuit / Power on Reset

## Sheet 10_PDM_MICS.SchDoc: PDM FPC Connector
size B; DocumentNumber: 6; SheetNumber: 6; SheetTotal: 12
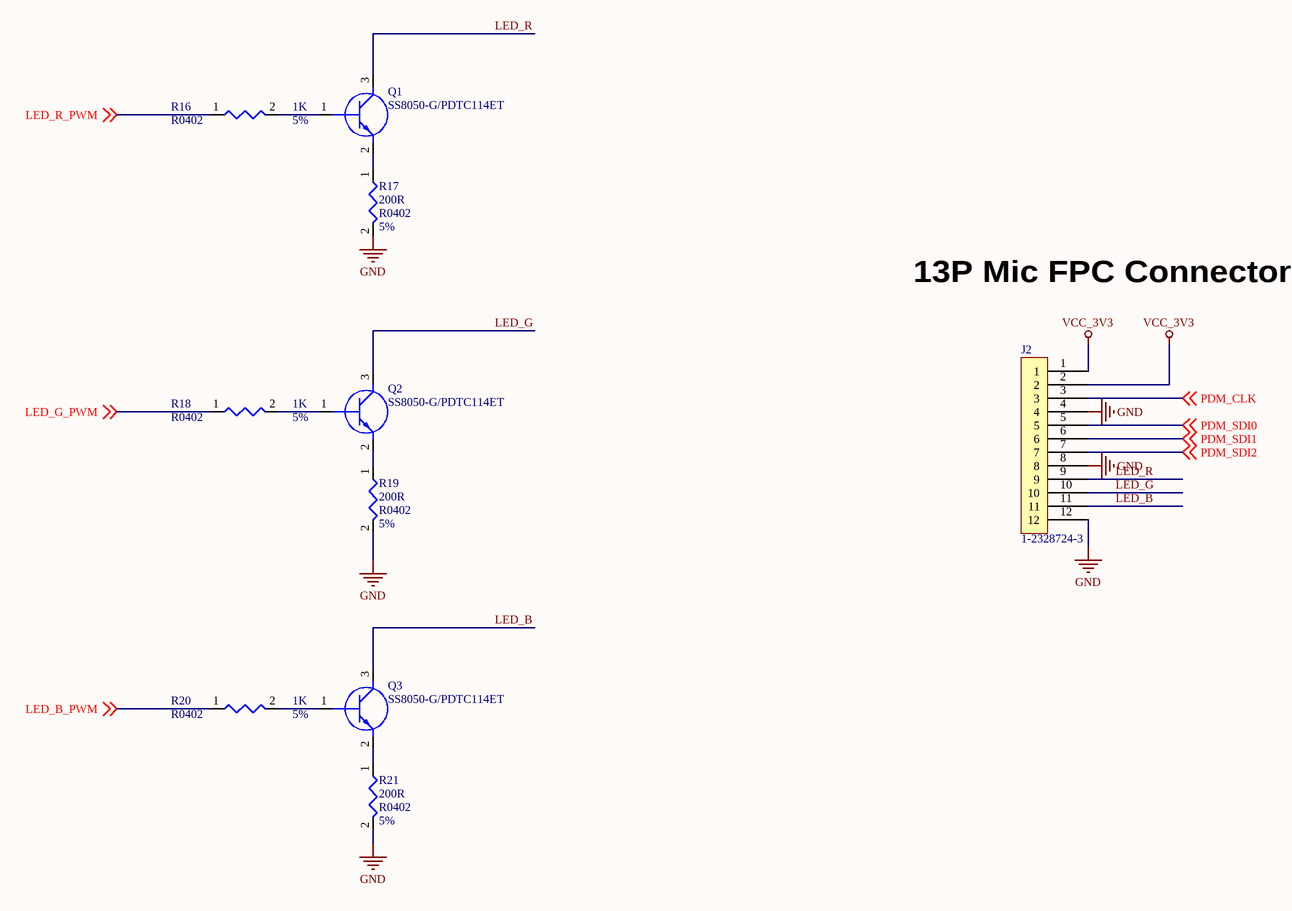
[diagram p6: 10_PDM_MICS.SchDoc]

### Parts
(Parts that share a designator on the sheet are numbered #1, #2 ... from top to bottom, then left to right.)
J2  1-2328724-3  [123287243]
Q1  SS8050-G/PDTC114ET  [SOT23]
Q2  SS8050-G/PDTC114ET  [SOT23]
Q3  SS8050-G/PDTC114ET  [SOT23]
R16#2  1K  Tolerance: 5%  [R0402]
R17#2  200R  Tolerance: 5%  [R0402]
R18#2  1K  Tolerance: 5%  [R0402]
R19  200R  Tolerance: 5%  [R0402]
R20  1K  Tolerance: 5%  [R0402]
R21  200R  Tolerance: 5%  [R0402]

### Nets
GND: J2.4 J2.8 J2.12 R17#2.2 R19.2 R21.2  [project net AGND]
VCC_3V3: J2.1 J2.2
LED_B: J2.11 Q3.3(C)
LED_B_PWM: R20.1 ; off-sheet LED_B_PWM
LED_G: J2.10 Q2.3(C)
LED_G_PWM: R18#2.1 ; off-sheet LED_G_PWM
LED_R: J2.9 Q1.3(C)
LED_R_PWM: R16#2.1 ; off-sheet LED_R_PWM
PDM_CLK: J2.3 ; off-sheet PDM_CLK
PDM_SDI0: J2.5 ; off-sheet PDM_SDI0
PDM_SDI1: J2.6 ; off-sheet PDM_SDI1
PDM_SDI2: J2.7 ; off-sheet PDM_SDI2
NetQ1_1: Q1.1(B) R16#2.2
NetQ1_2: Q1.2(E) R17#2.1
NetQ2_1: Q2.1(B) R18#2.2
NetQ2_2: Q2.2(E) R19.1
NetQ3_1: Q3.1(B) R20.2
NetQ3_2: Q3.2(E) R21.1

### Notes on the sheet
- 13P Mic FPC Connector
- Title
- Size:
- Date:
- B
- Number:
- Time:
- Revision:
- Sheet
- of
- Author: Edward Lai
- Email: edward@vibe.us
- Vibe Inc
- Hangzhou
- vibe.us <http://vibe.us>
- File:

### Library data of the parts
J2 = 12pP254: FFC & FPC连接器 13 PIN FPC CONNECTOR 0.3mmP FRONT FLIP
Q1-Q3 = SS8050-G: Transistor BJT NPN; Manufacturer_Name: Comchip Technology; Datasheet Link: https://componentsearchengine.com//SS8050-G.pdf; Height: 1.15mm; Mouser2 Part Number: 750-SS8050-G; Mouser2 Price/Stock: https://www.mouser.com/Search/Refine.aspx?Keyword=750-SS8050-G; Manufacturer_Part_Number: SS8050-G
R16#2 R18#2 R20 = RESISTOR: 通用厚膜电阻,1K,+/-5%,R0405; Priority: A; PCB Footprint: R0402; Part Type: 通用厚膜电阻
R17#2 R19 R21 = RESISTOR: 通用厚膜电阻,200R,+/-5%,R0402; Priority: A; PCB Footprint: R0402; Part Type: 通用厚膜电阻

## Sheet 11_ES7201_LOOPBACK.SchDoc: ES7201 Loopback
size B; DocumentNumber: 7; SheetNumber: 7; SheetTotal: 12
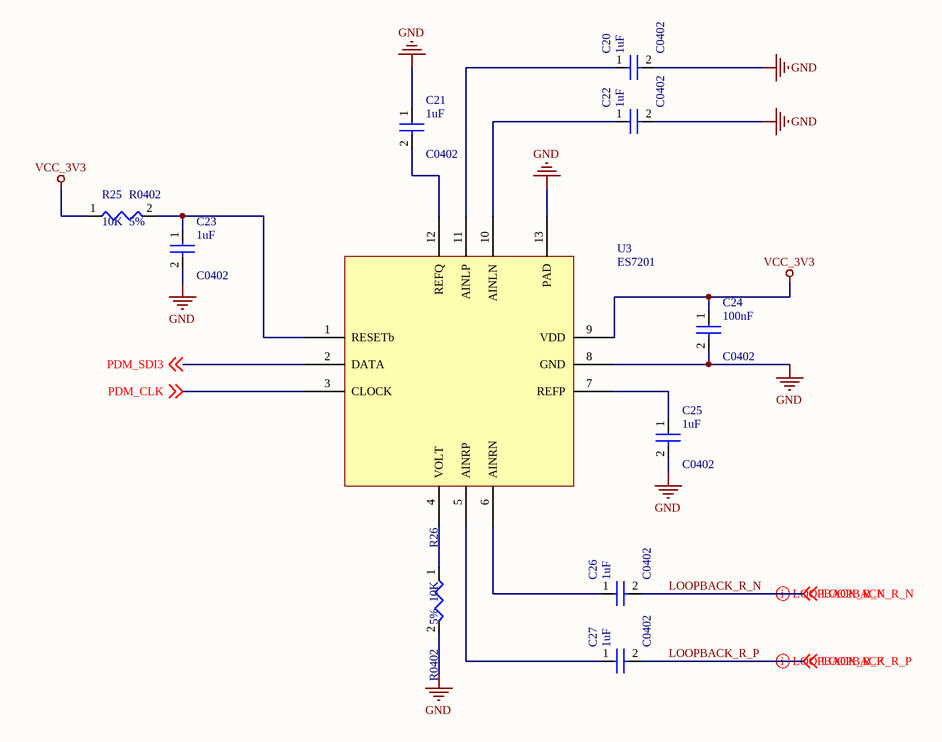
[diagram p7: 11_ES7201_LOOPBACK.SchDoc]

### Parts
C20  1uF  PCB Footprint: C0402  [C0402_L]
C21  1uF  PCB Footprint: C0402  [C0402_L]
C22  1uF  PCB Footprint: C0402  [C0402_L]
C23  1uF  PCB Footprint: C0402  [C0402_L]
C24  100nF  PCB Footprint: C0402  [C0402_L]
C25  1uF  PCB Footprint: C0402  [C0402_L]
C26  1uF  PCB Footprint: C0402  [C0402_L]
C27  1uF  PCB Footprint: C0402  [C0402_L]
R25  10K  Tolerance: 5%  [R0402]
R26  10K  Tolerance: 5%  [R0402]
U3  ES7201  [QFN12]

### Nets
GND: C20.2 C21.1 C22.2 C23.2 C24.2 C25.2 R26.2 U3.8(GND) U3.13(PAD)  [project net AGND]
VCC_3V3: C24.1 R25.1 U3.9(VDD)
LOOPBACK_R_N: C26.2 ; off-sheet LOOPBACK_R_N
LOOPBACK_R_P: C27.2 ; off-sheet LOOPBACK_R_P
PDM_CLK: U3.3(CLOCK) ; off-sheet PDM_CLK
PDM_SDI3: U3.2(DATA) ; off-sheet PDM_SDI3
NetC20_1: C20.1 U3.11(AINLP)
NetC21_2: C21.2 U3.12(REFQ)
NetC22_1: C22.1 U3.10(AINLN)
NetC23_1: C23.1 R25.2 U3.1(RESETb)
NetC25_1: C25.1 U3.7(REFP)
NetC26_1: C26.1 U3.6(AINRN)
NetC27_1: C27.1 U3.5(AINRP)
NetR26_1: R26.1 U3.4(VOLT)

### Layout directives
differential pair: LOOPBACK_R_N, LOOPBACK_R_P

### Notes on the sheet
- Title
- Size:
- Date:
- B
- Number:
- Time:
- Revision:
- Sheet
- of
- Author: Edward Lai
- Email: edward@vibe.us
- Vibe Inc
- Hangzhou
- vibe.us <http://vibe.us>
- File:

### Library data of the parts
C20-C23 C25-C27 = CAP NP_Dup1: cap,1.00uF,+/-10%,6.3V,X5R,C0402; Priority: A; Part Type: C0402
C24 = CAP NP_Dup1: as C7 on sheet 05_SM32_MCU; Part Type: C0402
R25 R26 = RESISTOR: 通用厚膜电阻,10K,+/-5%,R0402; Priority: A; PCB Footprint: R0402; Part Type: 通用厚膜电阻
U3 = ES7201: ES7201 PCM to PDM Convertor

## Sheet 12_ADAU7118_CODEC.SchDoc: ADAU7118 PDM to TDM Codec
size B; DocumentNumber: 8; SheetNumber: 8; SheetTotal: 12
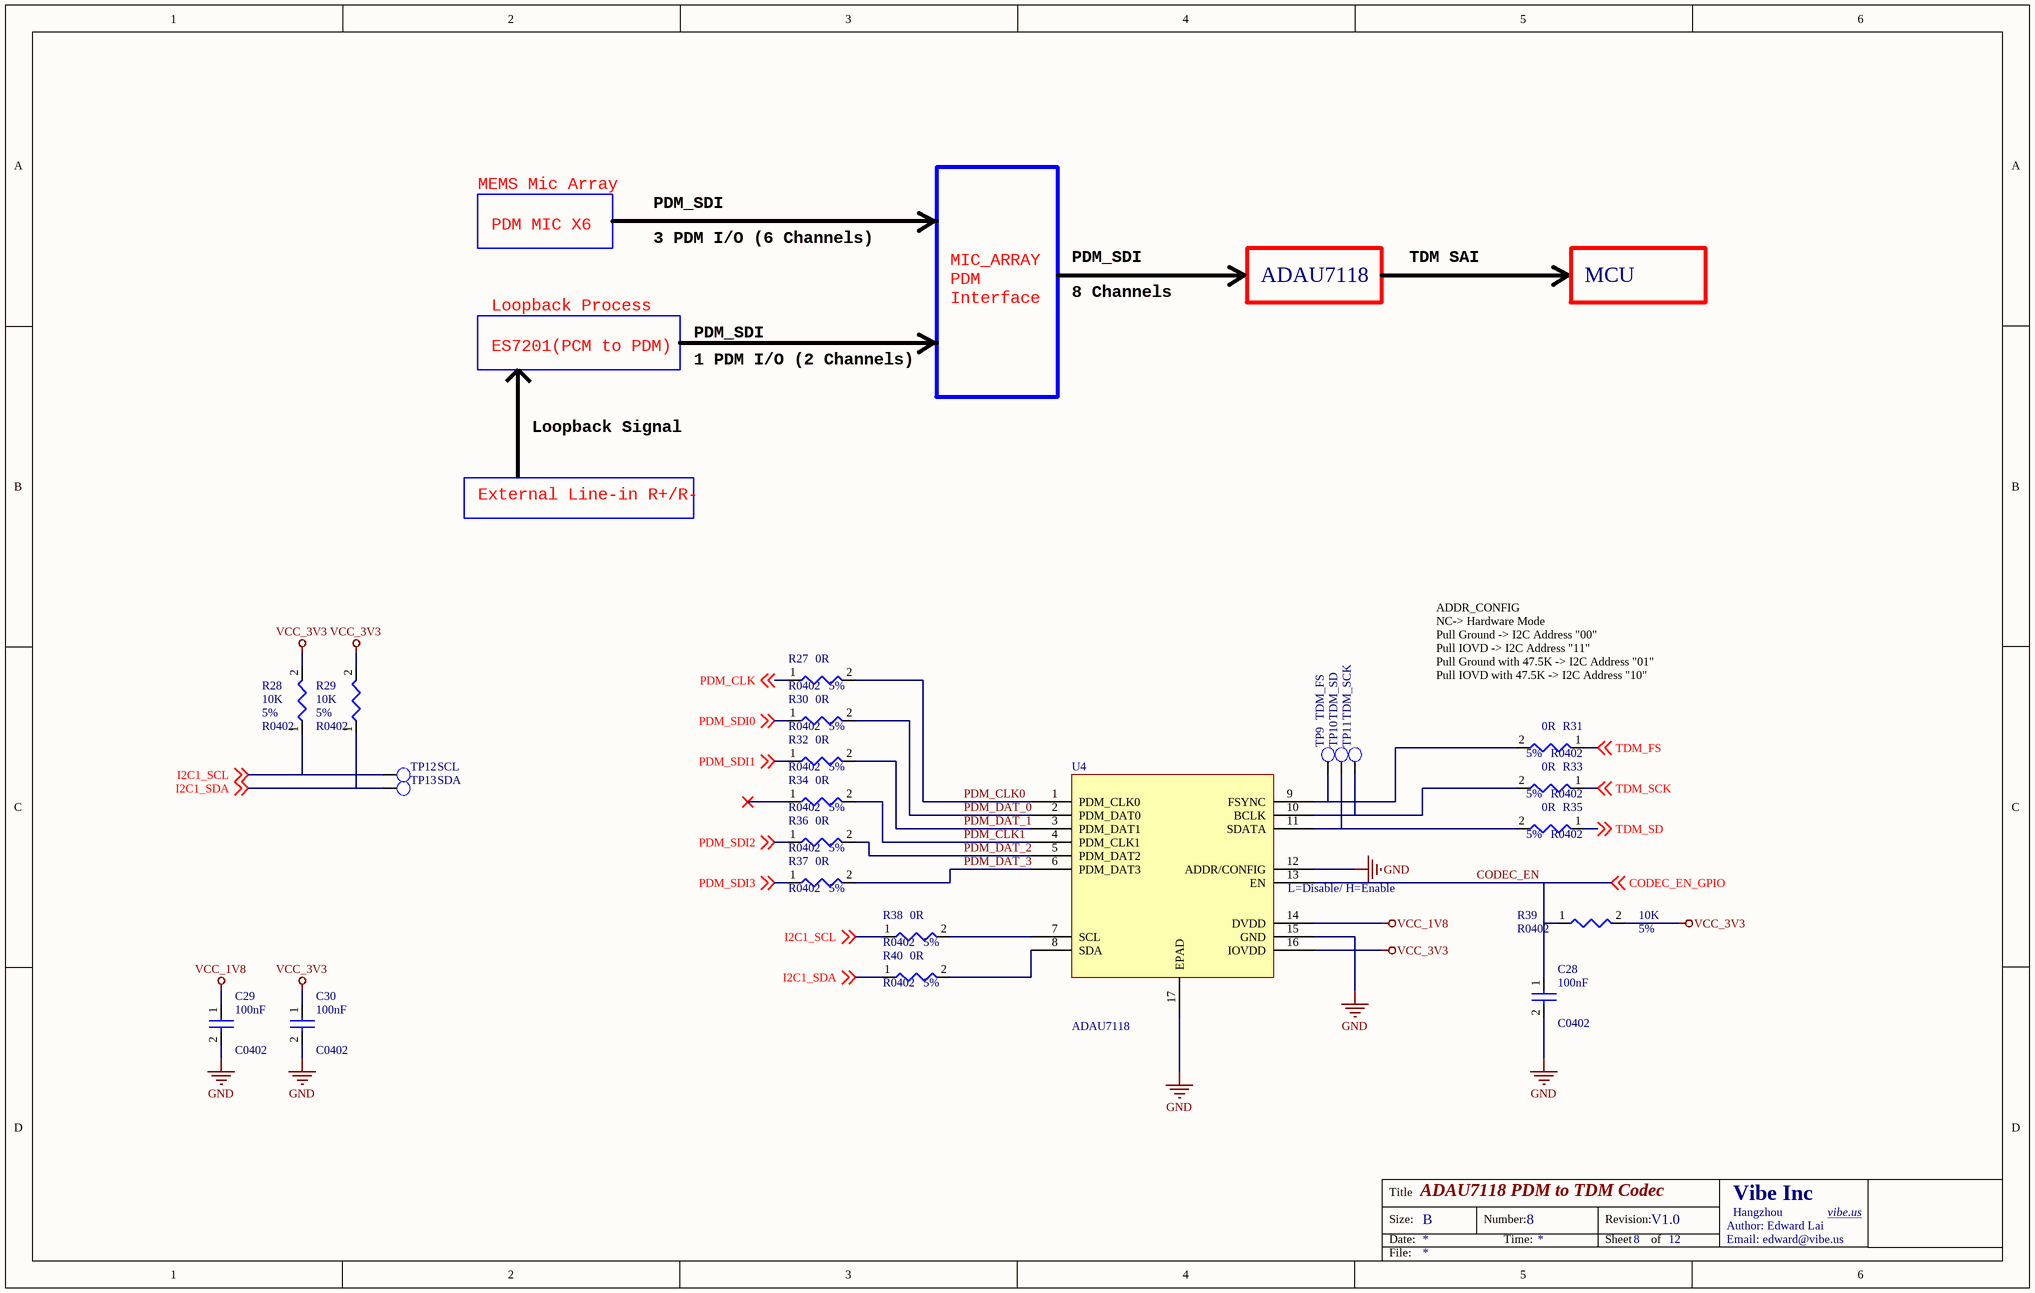
[diagram p8: 12_ADAU7118_CODEC.SchDoc]

### Parts
C28  100nF  PCB Footprint: C0402  [C0402_L]
C29  100nF  PCB Footprint: C0402  [C0402_L]
C30  100nF  PCB Footprint: C0402  [C0402_L]
R27  0R  Tolerance: 5%  [R0402]
R28  10K  Tolerance: 5%  [R0402]
R29  10K  Tolerance: 5%  [R0402]
R30  0R  Tolerance: 5%  [R0402]
R31  0R  Tolerance: 5%  [R0402]
R32  0R  Tolerance: 5%  [R0402]
R33  0R  Tolerance: 5%  [R0402]
R34  0R  Tolerance: 5%  [R0402]
R35  0R  Tolerance: 5%  [R0402]
R36  0R  Tolerance: 5%  [R0402]
R37  0R  Tolerance: 5%  [R0402]
R38  0R  Tolerance: 5%  [R0402]
R39  10K  Tolerance: 5%  [R0402]
R40  0R  Tolerance: 5%  [R0402]
TP9  TDM_FS  [TP_0R70]  (no BOM)
TP10  TDM_SD  [TP_0R70]  (no BOM)
TP11  TDM_SCK  [TP_0R70]  (no BOM)
TP12  SCL  [TP_0R70]  (no BOM)
TP13  SDA  [TP_0R70]  (no BOM)
U4  ADAU7118  [QFN50P300X300X80-17N]

### Nets
GND: C28.2 C29.2 C30.2 U4.12(ADDR/CONFIG) U4.15(GND) U4.17(EPAD)  [project net AGND]
VCC_1V8: C29.1 U4.14(DVDD)
VCC_3V3: C30.1 R28.2 R29.2 R39.2 U4.16(IOVDD)
CODEC_EN: C28.1 R39.1 U4.13(EN) ; off-sheet CODEC_EN_GPIO  [also labelled CODEC_EN_GPIO]
I2C1_SCL: R28.1 R38.1 TP12.1 ; off-sheet I2C1_SCL
I2C1_SDA: R29.1 R40.1 TP13.1 ; off-sheet I2C1_SDA
PDM_CLK: R27.1 ; off-sheet PDM_CLK
PDM_CLK0: R27.2 U4.1(PDM_CLK0)
PDM_CLK1: R34.2 U4.4(PDM_CLK1)
PDM_DAT_0: R30.2 U4.2(PDM_DAT0)
PDM_DAT_1: R32.2 U4.3(PDM_DAT1)
PDM_DAT_2: R36.2 U4.5(PDM_DAT2)
PDM_DAT_3: R37.2 U4.6(PDM_DAT3)
PDM_SDI0: R30.1 ; off-sheet PDM_SDI0
PDM_SDI1: R32.1 ; off-sheet PDM_SDI1
PDM_SDI2: R36.1 ; off-sheet PDM_SDI2
PDM_SDI3: R37.1 ; off-sheet PDM_SDI3
TDM_FS: R31.1 ; off-sheet TDM_FS  [project net SAI1_FS_B]
TDM_SCK: R33.1 ; off-sheet TDM_SCK  [project net SAI1_SCK_B]
TDM_SD: R35.1 ; off-sheet TDM_SD  [project net SAI1_SD_B]
NetR31_2: R31.2 TP9.1 U4.9(FSYNC)
NetR33_2: R33.2 TP11.1 U4.10(BCLK)
NetR35_2: R35.2 TP10.1 U4.11(SDATA)
NetR38_2: R38.2 U4.7(SCL)
NetR40_2: R40.2 U4.8(SDA)

Not connected (* = marked no-connect by the designer): R34 1*

### Notes on the sheet
- MEMS Mic Array
- PDM MIC X6
- PDM_SDI
- 3 PDM I/O (6 Channels)
- 8 Channels
- ADAU7118
- TDM SAI
- MCU
- ES7201(PCM to PDM)
- Loopback Process
- 1 PDM I/O (2 Channels)
- MIC_ARRAY PDM Interface
- Loopback Signal
- External Line-in R+/R-
- ADDR_CONFIG
  NC-> Hardware Mode
  Pull Ground -> I2C Address "00"
  Pull IOVD -> I2C Address "11"
  Pull Ground with 47.5K -> I2C Address "01"
  Pull IOVD with 47.5K -> I2C Address "10"
- (near U4) L=Disable/ H=Enable
- Title
- Size:
- Date:
- B
- Number:
- Time:
- Revision:
- Sheet
- of
- Author: Edward Lai
- Email: edward@vibe.us
- Vibe Inc
- Hangzhou
- vibe.us <http://vibe.us>
- File:

### Library data of the parts
C28-C30 = CAP NP_Dup1: cap,1.0uF,+/-10%,6.3V,C0402; Priority: A; Part Type: C0402
R27 R30-R38 R40 = RESISTOR: 通用厚膜电阻,0R,+/-5%,R0402; Priority: A; PCB Footprint: R0402; Part Type: 通用厚膜电阻
R28 R29 R39 = RESISTOR: 通用厚膜电阻,10K,+/-5%,R0402; Priority: A; PCB Footprint: R0402; Part Type: 通用厚膜电阻
TP9-TP13 = TP: as TP1 on sheet 05_SM32_MCU; Part Type: TP
U4 = ADAU7118: 16-lead, 3 mm × 3 mm, 0.50 mm pitch LFCSP

## Sheet 21_POWER_DOMAINS.SchDoc: Power Domains
size B; Author: Edward Lai; CompanyName: Vibe Inc; DrawnBy: Edward Lai; DocumentNumber: 10; SheetNumber: 10; SheetTotal: 12
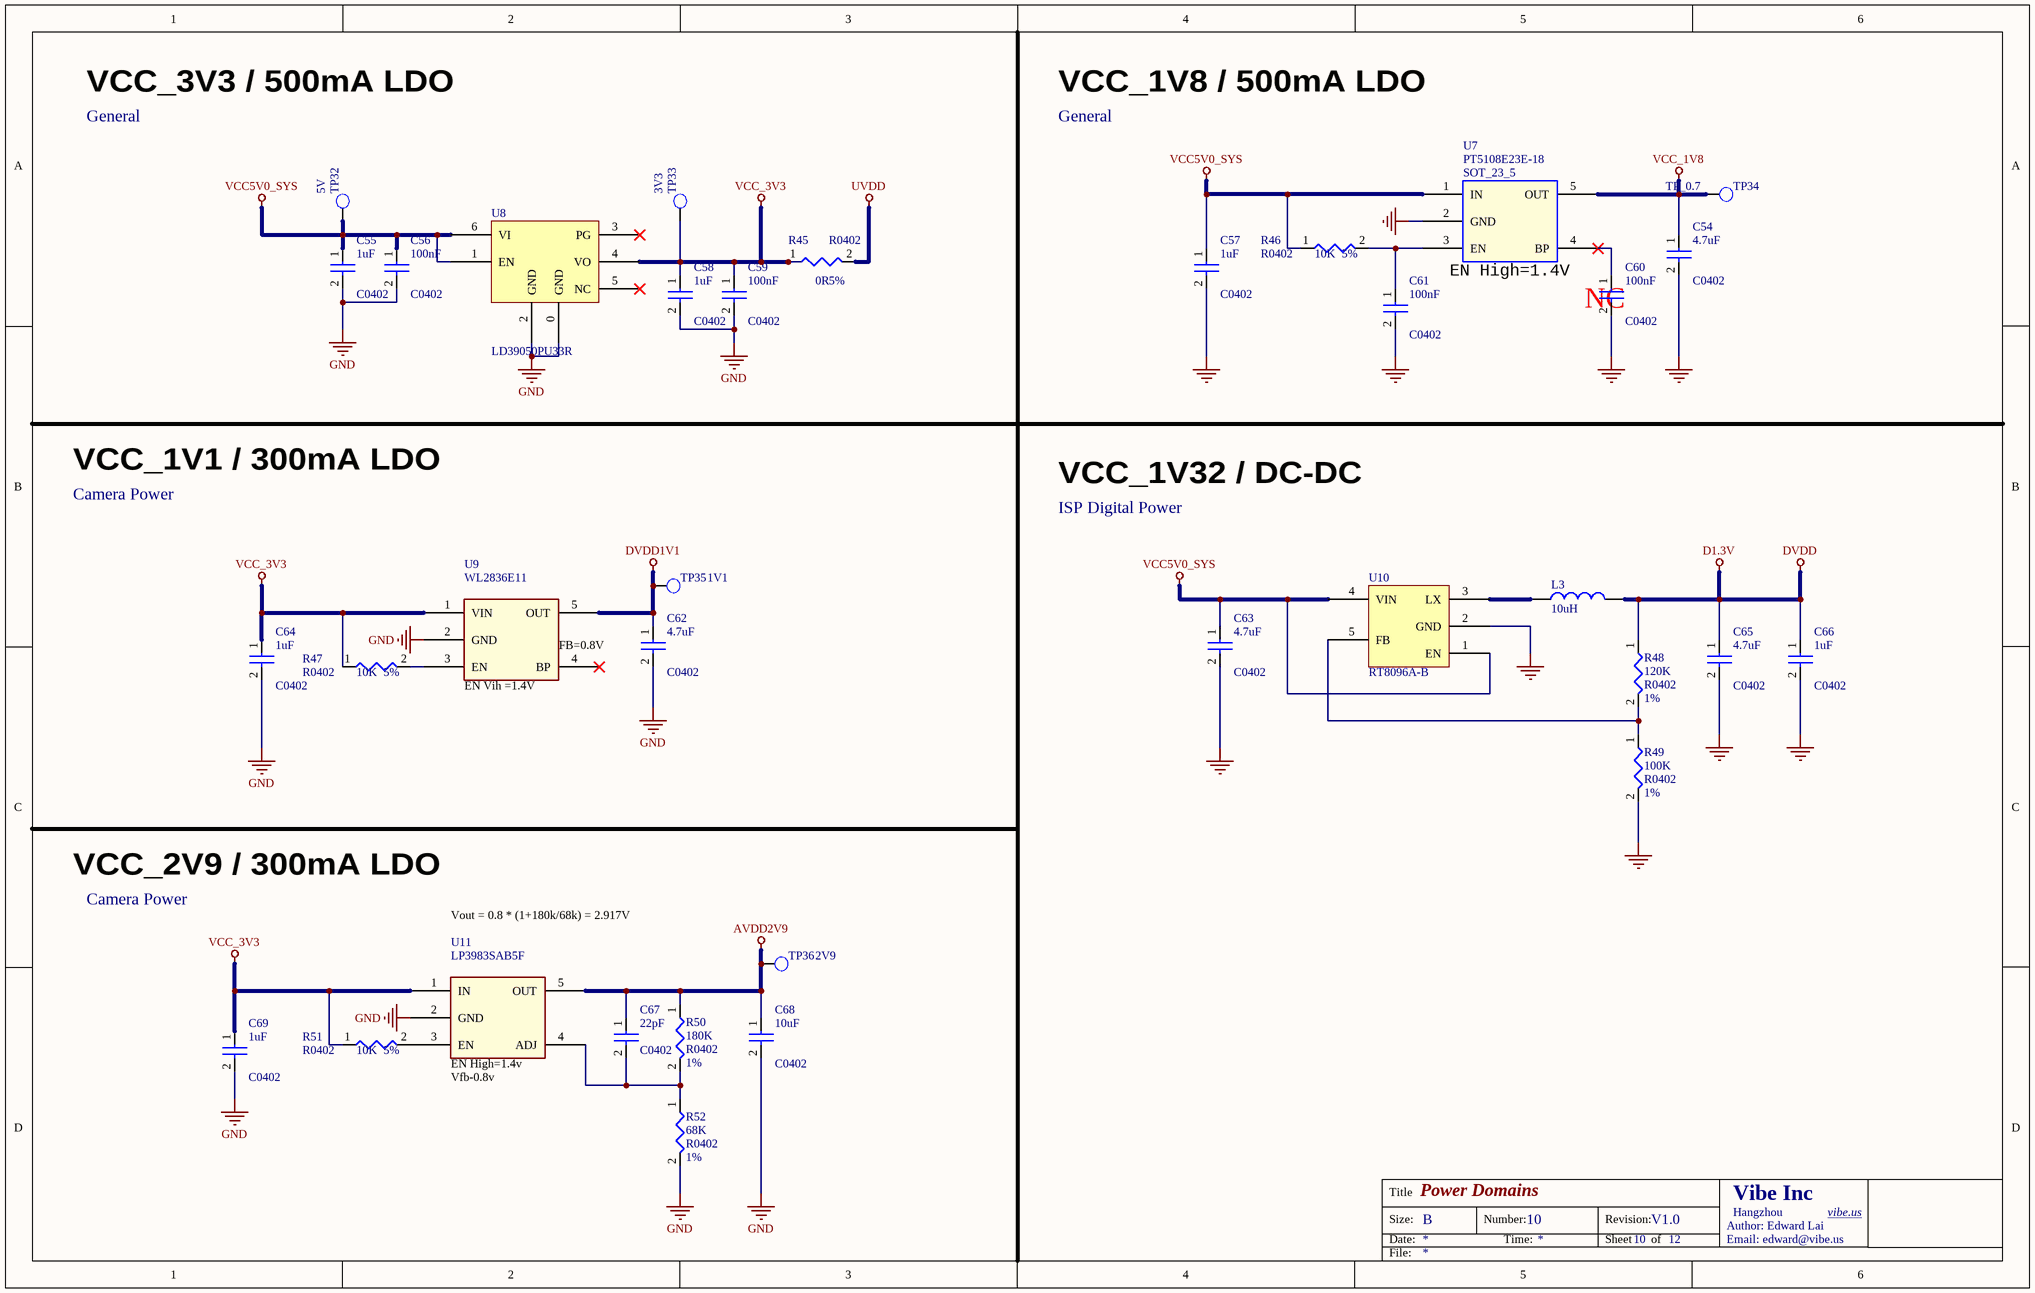
[diagram p9: 21_POWER_DOMAINS.SchDoc]

### Parts
(Parts that share a designator on the sheet are numbered #1, #2 ... from top to bottom, then left to right.)
C54#2  4.7uF  PCB Footprint: C0402  [C0402_L]
C55#2  1uF  PCB Footprint: C0402  [C0402_L]
C56#2  100nF  PCB Footprint: C0402  [C0402_L]
C57#2  1uF  PCB Footprint: C0402  [C0402_L]
C58#2  1uF  PCB Footprint: C0402  [C0402_L]
C59#2  100nF  PCB Footprint: C0402  [C0402_L]
C60#2  100nF  PCB Footprint: C0402  [C0402_L]  (net tie, no BOM)
C61#2  100nF  PCB Footprint: C0402  [C0402_L]
C62#2  4.7uF  PCB Footprint: C0402  [C0402_L]
C63#2  4.7uF  PCB Footprint: C0402  [C0402_L]
C64#2  1uF  PCB Footprint: C0402  [C0402_L]
C65#2  4.7uF  PCB Footprint: C0402  [C0402_L]
C66#2  1uF  PCB Footprint: C0402  [C0402_L]
C67#2  22pF  PCB Footprint: C0402  [C0402_L]
C68#2  10uF  PCB Footprint: C0402  [C0402_L]
C69#2  1uF  PCB Footprint: C0402  [C0402_L]
L3  10uH  [L0402]
R45#1  0R  Tolerance: 5%  [R0402]
R46#1  10K  Tolerance: 5%  [R0402]
R47#1  10K  Tolerance: 5%  [R0402]
R48#1  120K  Tolerance: 1%  [R0402]
R49#2  100K  Tolerance: 1%  [R0402]
R50#2  180K  Tolerance: 1%  [R0402]
R51#2  10K  Tolerance: 5%  [R0402]
R52#2  68K  Tolerance: 1%  [R0402]
TP32#2  5V  [TP_0R70]  (no BOM)
TP33#2  3V3  [TP_0R70]  (no BOM)
TP34#2  TP_0.7  [TP_0R70]  (net tie, no BOM)
TP35#2  1V1  [TP_0R70]  (no BOM)
TP36#2  2V9  [TP_0R70]  (no BOM)
U7  PT5108E23E-18  PCB Footprint: SOT_23_5  [SOT23-5]
U8  LD39050PU33R  [SON95P300X300X100-7N]
U9  WL2836E11  [SOT23-5]
U10#1  RT8096A-B  [SOT_23_5]
U11#2  LP3983SAB5F  [SOT23-5]

### Nets
AVDD2V9: C67#2.1 C68#2.1 R50#2.1 TP36#2.1 U11#2.5(OUT)
D1.3V: C65#2.1 C66#2.1 L3.2 R48#1.1  [also labelled DVDD]
DVDD1V1: C62#2.1 TP35#2.1 U9.5(OUT)
GND: C54#2.2 C55#2.2 C56#2.2 C57#2.2 C58#2.2 C59#2.2 C60#2.2 C61#2.2 C62#2.2 C63#2.2 C64#2.2 C65#2.2 C66#2.2 C68#2.2 C69#2.2 R49#2.2 R52#2.2 U7.2(GND) U8.0(GND) U8.2(GND) U9.2(GND) U10#1.2(GND) U11#2.2(GND)  [project net AGND]
UVDD: R45#1.2
VCC5V0_SYS: C55#2.1 C56#2.1 C57#2.1 C63#2.1 R46#1.1 TP32#2.1 U7.1(IN) U8.1(EN) U8.6(VI) U10#1.1(EN) U10#1.4(VIN)
VCC_1V8: C54#2.1 TP34#2.1 U7.5(OUT)
VCC_3V3: C58#2.1 C59#2.1 C64#2.1 C69#2.1 R45#1.1 R47#1.1 R51#2.1 TP33#2.1 U8.4(VO) U9.1(VIN) U11#2.1(IN)
NetC60#2_1: C60#2.1 U7.4(BP)
NetC61#2_1: C61#2.1 R46#1.2 U7.3(EN)
NetC67#2_2: C67#2.2 R50#2.2 R52#2.1 U11#2.4(ADJ)
NetL3_1: L3.1 U10#1.3(LX)
NetR47#1_2: R47#1.2 U9.3(EN)
NetR48#1_2: R48#1.2 R49#2.1 U10#1.5(FB)
NetR51#2_2: R51#2.2 U11#2.3(EN)

Not connected (* = marked no-connect by the designer): U8 3(PG)* 5(NC)*; U9 4(BP)*

### Notes on the sheet
- VCC_3V3 / 500mA LDO
- VCC_1V8 / 500mA LDO
- General
- (near U7) EN High=1.4V
- (near C60#2) NC
- VCC_1V1 / 300mA LDO
- Camera Power
- VCC_1V32 / DC-DC
- ISP Digital Power
- (near U9) EN Vih =1.4V
- (near U9) FB=0.8V
- VCC_2V9 / 300mA LDO
- Vout = 0.8 * (1+180k/68k) = 2.917V
- (near U11#2) EN High=1.4v
- (near U11#2) Vfb-0.8v
- Title
- Size:
- Date:
- B
- Number:
- Time:
- Revision:
- Sheet
- of
- Author: Edward Lai
- Email: edward@vibe.us
- Vibe Inc
- Hangzhou
- vibe.us <http://vibe.us>
- File:

### Library data of the parts
C54#2 C62#2 C63#2 C65#2 = CAP NP_Dup1: as C4 on sheet 05_SM32_MCU; Part Type: C0402
C55#2 C58#2 C64#2 C69#2 = CAP NP_Dup1: as C70 on sheet 07_ISP; Part Type: C0402
C56#2 C59#2 = CAP NP_Dup1: cap,1.0uF,+/-10%,6.3V,C0402; Priority: A; Part Type: C0402
C57#2 C66#2 = CAP NP_Dup1: as C1 on sheet 05_SM32_MCU; Part Type: C0402
C60#2 C61#2 = CAP NP_Dup1: as C7 on sheet 05_SM32_MCU; Part Type: C0402
C67#2 = CAP NP_Dup1: cap,22pF,+/-10%,6.3V,X5R,C0402; Priority: A; Part Type: C0402
C68#2 = CAP NP_Dup1: cap,10uF,+/-10%,6.3V,X5R,C0402; Priority: A; Part Type: C0402
L3 = L: 贴片小功率电感
R45#1 = RESISTOR: 通用厚膜电阻,0R,+/-5%,R0402; Priority: A; PCB Footprint: R0402; Part Type: 通用厚膜电阻
R46#1 R47#1 R51#2 = RESISTOR: 通用厚膜电阻,10K,+/-5%,R0402; Priority: A; PCB Footprint: R0402; Part Type: 通用厚膜电阻
R48#1 R50#2 = RESISTOR: 通用厚膜电阻,180K,+/-1%,R0402,1/16W.; Priority: A; PCB Footprint: R0402; Part Type: 通用厚膜电阻
R49#2 = RESISTOR: 通用厚膜电阻,100K,+/-1%,R0402; Priority: A; PCB Footprint: R0402; Part Type: 通用厚膜电阻
R52#2 = RESISTOR: 通用厚膜电阻,68K,+/-1%,R0402; Priority: A; PCB Footprint: R0402; Part Type: 通用厚膜电阻
TP32#2 TP33#2 TP34#2 TP35#2 TP36#2 = TP: as TP1 on sheet 05_SM32_MCU; Part Type: TP
U7 = LDO_PT5108: High-PSRR 600mA LDO.Output1.8V.; Priority: A; Part Type: LDO
U8 = LD39050PU33R: LD39050PU33R / 6-DFN (3x3) / Output 500mA
U9 = DCDC_WL2836E: WL2836E11 DCDC for CMOS Sensor
U10#1 = RT8096A-B: RT8096A-B / SOT-23-5
U11#2 = DCDC_LP3983S: LP3983SAB5F 2V9 DCfor CMOS SensorSOT_23_5

## Sheet 22_USB_CONNECTOR.SchDoc: USB-C Connector
size A; DocumentNumber: 11; SheetNumber: 11; SheetTotal: 12
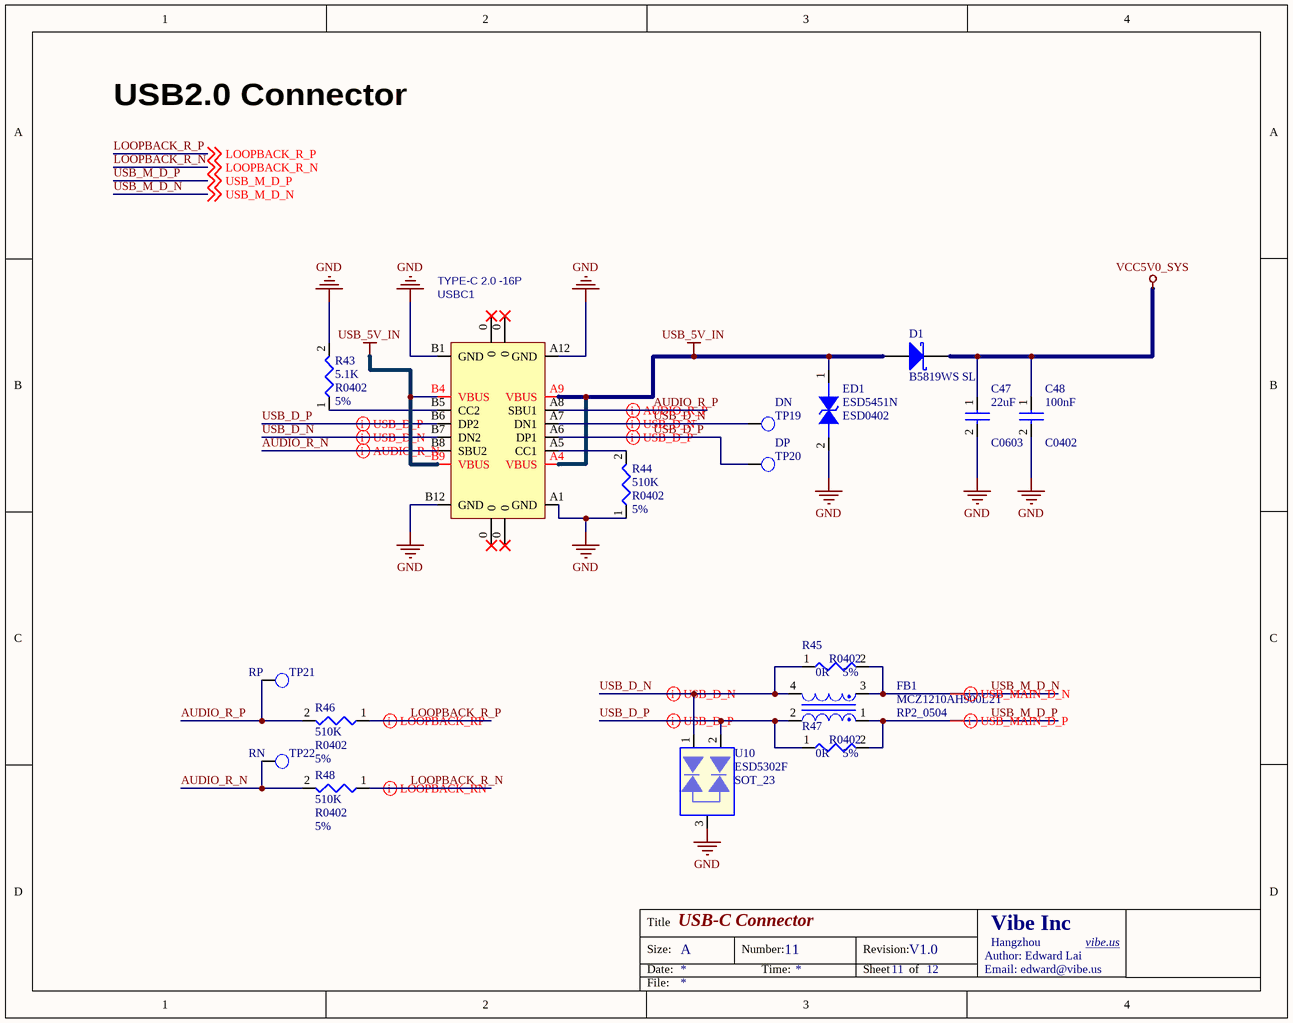
[diagram p10: 22_USB_CONNECTOR.SchDoc]

### Parts
(Parts that share a designator on the sheet are numbered #1, #2 ... from top to bottom, then left to right.)
C47  22uF  PCB Footprint: C0603  [C0603_L]
C48  100nF  PCB Footprint: C0402  [C0402_L]
D1  B5819WS SL  [SOD-323]
ED1  ESD5451N  [ESD0402]
FB1  MCZ1210AH900L2T  PCB Footprint: RP2_0504  [L0402D]  (net tie, no BOM)
R43  5.1K  Tolerance: 5%  [R0402]
R44  510K  Tolerance: 5%  [R0402]
R45#2  0R  Tolerance: 5%  [R0402]
R46#2  510K  Tolerance: 5%  [R0402]
R47#2  0R  Tolerance: 5%  [R0402]
R48#2  510K  Tolerance: 5%  [R0402]
TP19  DN  [TP_0R70]  (no BOM)
TP20  DP  [TP_0R70]  (no BOM)
TP21  RP  [TP_0R70]  (no BOM)
TP22  RN  [TP_0R70]  (no BOM)
U10#2  ESD5302F  PCB Footprint: SOT_23  [SOT23]
USBC1  TYPE-C 2.0 -16P  [USB-C-SMD_16P]

### Nets
GND: C47.2 C48.2 ED1.2 R43.2 R44.1 U10#2.3 USBC1.A1(GND) USBC1.A12(GND) USBC1.B1(GND) USBC1.B12(GND)  [project net AGND]
USB_5V_IN: D1.1(A) ED1.1 USBC1.A4(VBUS) USBC1.A9(VBUS) USBC1.B4(VBUS) USBC1.B9(VBUS)
VCC5V0_SYS: C47.1 C48.1 D1.2(K)
AUDIO_R_N: R48#2.2 TP22.1 USBC1.B8(SBU2)
AUDIO_R_P: R46#2.2 TP21.1 USBC1.A8(SBU1)
LOOPBACK_R_N: R48#2.1 ; off-sheet LOOPBACK_R_N
LOOPBACK_R_P: R46#2.1 ; off-sheet LOOPBACK_R_P
USB_D_N: FB1.4 R45#2.1 TP19.1 U10#2.1 USBC1.A7(DN1) USBC1.B7(DN2)
USB_D_P: FB1.2 R47#2.1 TP20.1 U10#2.2 USBC1.A6(DP1) USBC1.B6(DP2)
USB_M_D_N: FB1.3 R45#2.2 ; off-sheet USB_M_D_N
USB_M_D_P: FB1.1 R47#2.2 ; off-sheet USB_M_D_P
NetR43_1: R43.1 USBC1.B5(CC2)
NetR44_2: R44.2 USBC1.A5(CC1)

Not connected (* = marked no-connect by the designer): USBC1 0*

### Layout directives
differential pair; differential pair class AUDIO_IN; net class AUDIO_DIFF: AUDIO_R_N, AUDIO_R_P, LOOPBACK_R_N, LOOPBACK_R_P
differential pair; differential pair class USB; net class USB: USB_D_N, USB_D_P
differential pair; differential pair class USB: USB_D_N, USB_D_P, USB_M_D_N, USB_M_D_P

### Notes on the sheet
- USB2.0 Connector
- Title
- Size:
- Date:
- A
- Number:
- Time:
- Revision:
- Sheet
- of
- Author: Edward Lai
- Email: edward@vibe.us
- Vibe Inc
- Hangzhou
- vibe.us <http://vibe.us>
- File:

### Library data of the parts
C47 = CAP NP_Dup1: cap,22.00uF,+/-10%,10V,X5R,C0603; Priority: A; Part Type: C0603
C48 = CAP NP_Dup1: as C7 on sheet 05_SM32_MCU; Part Type: C0402
D1 = SS14: B5819WS SL 肖特基二极管 / SOD-323; Part Type: SS14
ED1 = DIODE BI_DIR TRIG: 1-Line, Bi-directional, Transient Voltage Suppressors.17.5pF.; Priority: A; PCB Footprint: ESD0402; Part Type: ESD_TVS
FB1 = INDUCTOR COM: MCZ1210AH900L2T, 0603 90Ohm 100MHz; Priority: A; Part Type: BEAD
R43 = RESISTOR: 通用厚膜电阻,5.1K,+/-5%,R0402; Priority: A; PCB Footprint: R0402; Part Type: 通用厚膜电阻
R44 R46#2 R48#2 = RESISTOR: 通用厚膜电阻,510K,+/-1%,R0402; Priority: A; PCB Footprint: R0402; Part Type: 通用厚膜电阻
R45#2 R47#2 = RESISTOR: 通用厚膜电阻,0R,+/-5%,R0402; Priority: A; PCB Footprint: R0402; Part Type: 通用厚膜电阻
TP19-TP22 = TP: as TP1 on sheet 05_SM32_MCU; Part Type: TP
U10#2 = ESD_ESDA6V8UL: 2-Lines, Uni-directional,Ultra-low Capacitance.Transient Voltage Suppressors; Priority: A; Part Type: ESD_TVS
USBC1 = USB2.0_Type-C_16Pin: USB2.0_Type-C_16Pin母座

## Sheet 99_MISCS.SchDoc: Miscellaneous
size A; DocumentNumber: 12; SheetNumber: 12; SheetTotal: 12
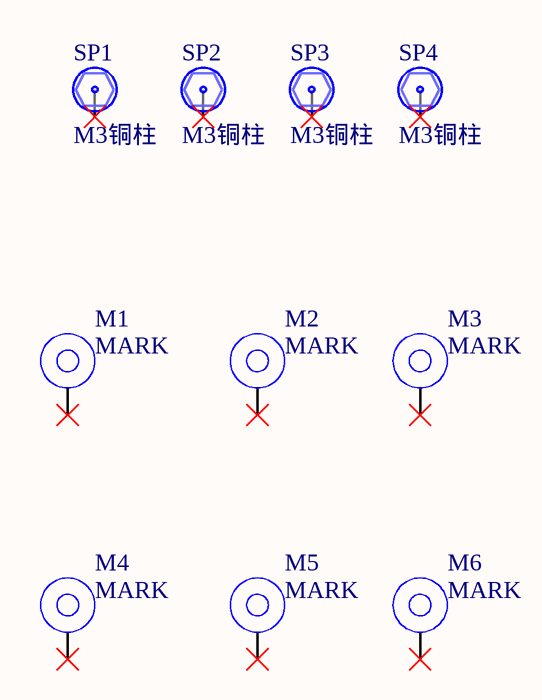
[diagram p11: 99_MISCS.SchDoc]

### Parts
M1  MARK  [MARK]  (net tie, no BOM)
M2  MARK  [MARK]  (net tie, no BOM)
M3  MARK  [MARK]  (net tie, no BOM)
M4  MARK  [MARK]  (net tie, no BOM)
M5  MARK  [MARK]  (net tie, no BOM)
M6  MARK  [MARK]  (net tie, no BOM)
SP1  M3铜柱  [M3x4_N]  (net tie, no BOM)
SP2  M3铜柱  [M3x4_N]  (net tie, no BOM)
SP3  M3铜柱  [M3x4_N]  (net tie, no BOM)
SP4  M3铜柱  [M3x4_N]  (net tie, no BOM)

### Nets

Not connected (* = marked no-connect by the designer): M1 1*; M2 1*; M3 1*; M4 1*; M5 1*; M6 1*; SP1 1*; SP2 1*; SP3 1*; SP4 1*

### Notes on the sheet
- Title
- Size:
- Date:
- A
- Number:
- Time:
- Revision:
- Sheet
- of
- Author: Edward Lai
- Email: edward@vibe.us
- Vibe Inc
- Hangzhou
- vibe.us <http://vibe.us>
- File:

### Library data of the parts
M1-M6 = MARK: PCBA MARKS
SP1-SP4 = 铜柱大焊盘: 铜柱

## Sheet temp_packages.SchDoc: Test
size D
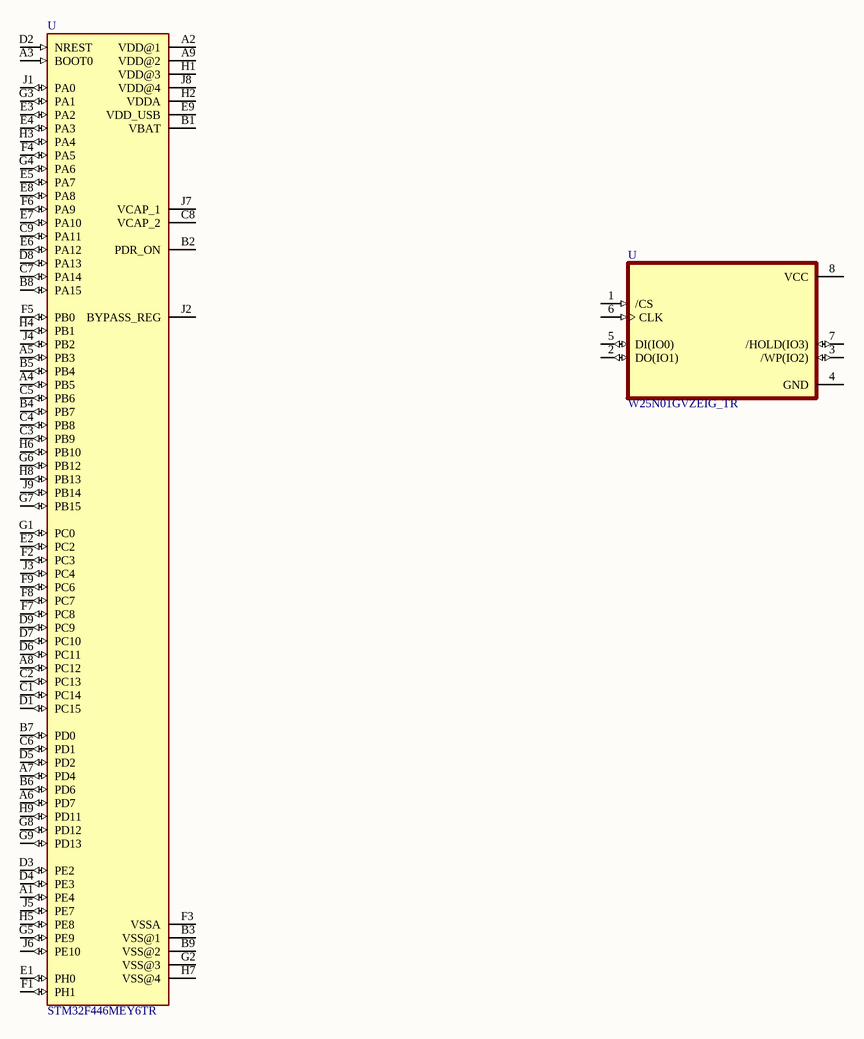
[diagram p12: temp_packages.SchDoc]

### Parts
(Parts that share a designator on the sheet are numbered #1, #2 ... from top to bottom, then left to right.)
U#1  W25N01GVZEIG_TR  [SON95P300X300X100-7N]
U#2  STM32F446MEY6TR  [BGA81C40P9X9_368X383X60]

### Nets

Not connected (* = marked no-connect by the designer): U#1 1(/CS) 2(DO(IO1)) 3(/WP(IO2)) 4(GND) 5(DI(IO0)) 6(CLK) 7(/HOLD(IO3)) 8(VCC); U#2 A1(PE4) A2(VDD@1) A3(BOOT0) A4(PB5) A5(PB3) A6(PD7) A7(PD4) A8(PC12) A9(VDD@2) B1(VBAT) B2(PDR_ON) B3(VSS@1) B4(PB7) B5(PB4) B6(PD6) B7(PD0) B8(PA15) B9(VSS@2) C1(PC14) C2(PC13) C3(PB9) C4(PB8) C5(PB6) C6(PD1) C7(PA14) C8(VCAP_2) C9(PA11) D1(PC15) D2(NREST) D3(PE2) D4(PE3) D5(PD2) D6(PC11) D7(PC10) D8(PA13) D9(PC9) E1(PH0) E2(PC2) E3(PA2) E4(PA3) E5(PA7) E6(PA12) E7(PA10) E8(PA8) E9(VDD_USB) F1(PH1) F2(PC3) F3(VSSA) F4(PA5) F5(PB0) F6(PA9) F7(PC8) F8(PC7) F9(PC6) G1(PC0) G2(VSS@3) G3(PA1) G4(PA6) G5(PE9) G6(PB12) G7(PB15) G8(PD12) G9(PD13) H1(VDD@3) H2(VDDA) H3(PA4) H4(PB1) H5(PE8) H6(PB10) H7(VSS@4) H8(PB13) H9(PD11) J1(PA0) J2(BYPASS_REG) J3(PC4) J4(PB2) J5(PE7) J6(PE10) J7(VCAP_1) J8(VDD@4) J9(PB14)

### Notes on the sheet
- Title
- Size:
- Date:
- File:
- D
- Number:
- Time:
- Revision:
- Sheet
- of
- Author: Edward Lai
- Email: edward@vibe.us
- Vibe Inc
- Hangzhou
- vibe.us <http://vibe.us>

### Library data of the parts
U#1 = W25N01GVZEIG_TR: FLASH - NAND Memory IC 1Gb _128M x 8_ SPI 104MHz 8-WSON _8x6_; MP: W25N01GVZEIG TR; MF: Winbond Electronics; Price: None; Package: WSON-8 Winbond; Value: *; Availability: Unavailable; SnapEDA_Link: https://www.snapeda.com/parts/W25N01GVZEIG%20TR/Winbond%20Electronics/view-part/1101444/?ref=snap
U#2 = STM32F446MEY6TR: ARMÂ® CortexÂ®-M4 STM32F4 Microcontroller IC 32-Bit 180MHz 512KB _512K x 8_ FLASH 81-WLCSP _3.80x3.69_; MF: STMicroelectronics; Package: WLCSP-81 STMicroelectronics; MP: STM32F446MEY6TR; SnapEDA_Link: https://www.snapeda.com/parts/STM32F446MEY6TR/STMicroelectronics/view-part/378075/?ref=snap; Price: None; Value: *; Availability: Unavailable

## Nets that join several sheets
AGND: 05_SM32_MCU (25 pins), 06_USB_HUB20 (13 pins), 07_ISP (45 pins), 10_PDM_MICS (6 pins), 11_ES7201_LOOPBACK (9 pins), 12_ADAU7118_CODEC (6 pins), 21_POWER_DOMAINS (23 pins), 22_USB_CONNECTOR (10 pins)
AVDD2V9: 07_ISP (C66#1.1 C67#1.1 J3.25 TP38.1), 21_POWER_DOMAINS (5 pins)
DVDD1V1: 07_ISP (C68#1.1 C69#1.1 J3.24 TP39.1), 21_POWER_DOMAINS (C62#2.1 TP35#2.1 U9.5)
VCC5V0_SYS: 06_USB_HUB20 (R17#1.1 U2.23), 21_POWER_DOMAINS (11 pins), 22_USB_CONNECTOR (C47.1 C48.1 D1.2)
VCC_1V8: 12_ADAU7118_CODEC (C29.1 U4.14), 21_POWER_DOMAINS (C54#2.1 TP34#2.1 U7.5)
VCC_3V3: 05_SM32_MCU (13 pins), 06_USB_HUB20 (8 pins), 07_ISP (17 pins), 10_PDM_MICS (J2.1 J2.2), 11_ES7201_LOOPBACK (C24.1 R25.1 U3.9), 12_ADAU7118_CODEC (5 pins), 21_POWER_DOMAINS (11 pins)
CODEC_EN: 05_SM32_MCU (R4.1), 12_ADAU7118_CODEC (C28.1 R39.1 U4.13)
HUB1_D_N: 06_USB_HUB20 (TP3.1 U2.27), 07_ISP (U11#1.21)
HUB1_D_P: 06_USB_HUB20 (TP4.1 U2.28), 07_ISP (U11#1.22)
HUB2_D_N: 05_SM32_MCU (U1.44), 06_USB_HUB20 (TP5.1 U2.2)
HUB2_D_P: 05_SM32_MCU (U1.45), 06_USB_HUB20 (TP6.1 U2.3)
I2C1_SCL: 05_SM32_MCU (U1.58), 12_ADAU7118_CODEC (R28.1 R38.1 TP12.1)
I2C1_SDA: 05_SM32_MCU (U1.59), 12_ADAU7118_CODEC (R29.1 R40.1 TP13.1)
LED_B_PWM: 05_SM32_MCU (U1.16), 10_PDM_MICS (R20.1)
LED_G_PWM: 05_SM32_MCU (U1.15), 10_PDM_MICS (R18#2.1)
LED_R_PWM: 05_SM32_MCU (U1.14), 10_PDM_MICS (R16#2.1)
LOOPBACK_R_N: 11_ES7201_LOOPBACK (C26.2), 22_USB_CONNECTOR (R48#2.1)
LOOPBACK_R_P: 11_ES7201_LOOPBACK (C27.2), 22_USB_CONNECTOR (R46#2.1)
PDM_CLK: 10_PDM_MICS (J2.3), 11_ES7201_LOOPBACK (U3.3), 12_ADAU7118_CODEC (R27.1)
PDM_SDI0: 10_PDM_MICS (J2.5), 12_ADAU7118_CODEC (R30.1)
PDM_SDI1: 10_PDM_MICS (J2.6), 12_ADAU7118_CODEC (R32.1)
PDM_SDI2: 10_PDM_MICS (J2.7), 12_ADAU7118_CODEC (R36.1)
PDM_SDI3: 11_ES7201_LOOPBACK (U3.2), 12_ADAU7118_CODEC (R37.1)
SAI1_FS_B: 05_SM32_MCU (U1.62), 12_ADAU7118_CODEC (R31.1)
SAI1_SCK_B: 05_SM32_MCU (U1.33), 12_ADAU7118_CODEC (R33.1)
SAI1_SD_B: 05_SM32_MCU (U1.42), 12_ADAU7118_CODEC (R35.1)
USB_M_D_N: 06_USB_HUB20 (TP7.1 U2.25), 22_USB_CONNECTOR (FB1.3 R45#2.2)
USB_M_D_P: 06_USB_HUB20 (TP8.1 U2.26), 22_USB_CONNECTOR (FB1.1 R47#2.2)
XHIGHDRV: 05_SM32_MCU (R3.1), 07_ISP (R52#1.2 U11#1.16)